# EAGLE design 7DI_V2 R2 (EAGLE 8.6.0)

## Sheet 1 of 8: Contine las fuentes
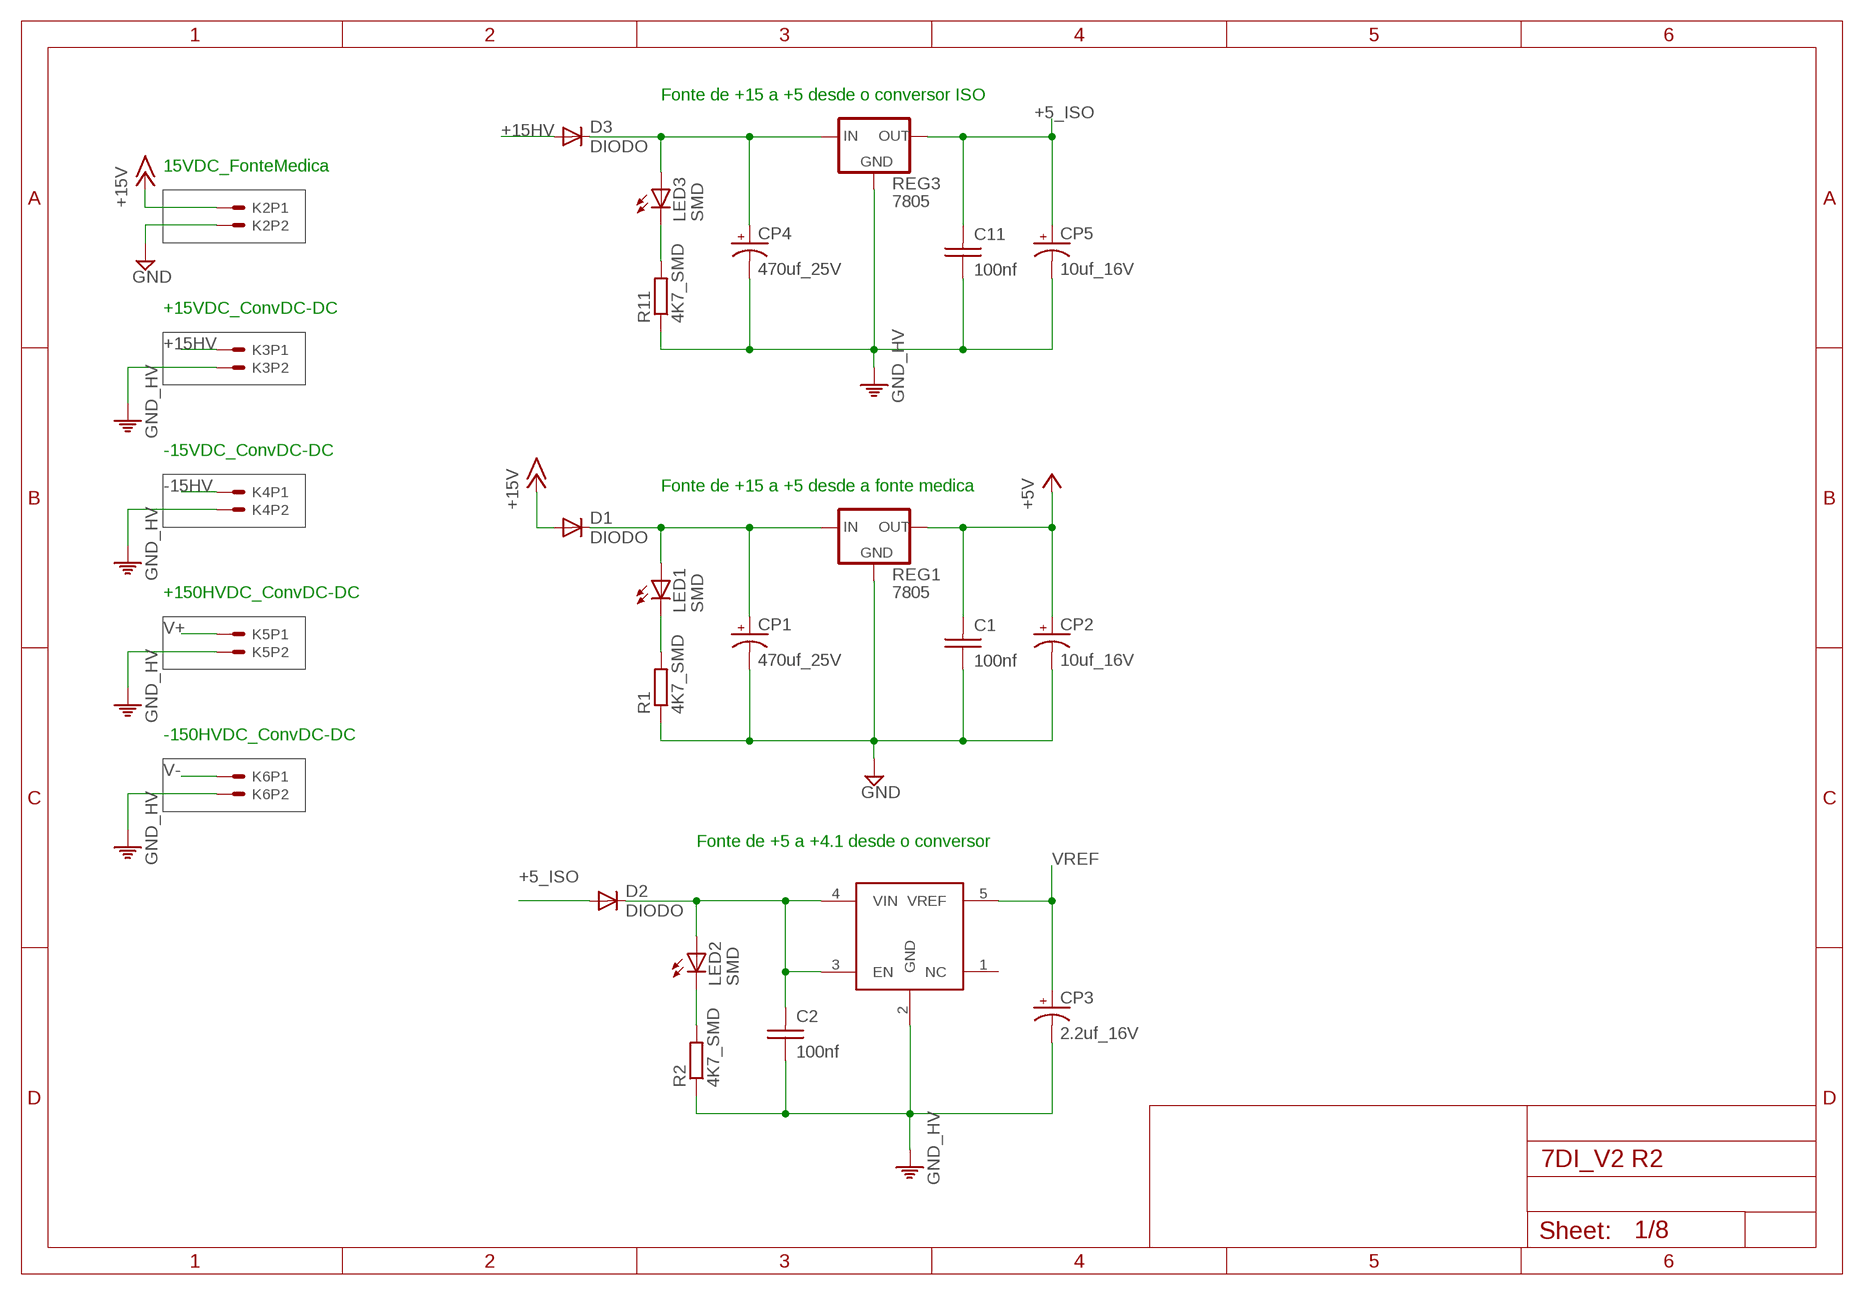
[diagram p0: schematic, sheet 1]

### Parts
C1  100nf  CAP_CERAMICO_TH5  [CAP_CER_5,08-024X044]
C2  100nf  CAP_CERAMICO_SMD  [CAP_CER_SMD-0805]
C11  100nf  CAP_CERAMICO_TH5  [CAP_CER_5,08-024X044]
CP1  470uf_25V  CAP_POLARIZADOCAP_T3,5-D8  [CAP_T_3,5-D8]
CP2  10uf_16V  CAP_POLARIZADOCAP_T2,5-D5  [CAP_T_2,5-D5]
CP3  2.2uf_16V  CAP_POLARIZADOCAPDAC  [153CLV-0605]
CP4  470uf_25V  CAP_POLARIZADOCAP_T3,5-D8  [CAP_T_3,5-D8]
CP5  10uf_16V  CAP_POLARIZADOCAP_T2,5-D5  [CAP_T_2,5-D5]
D1  DIODO  DIODOT_5  [D-5]
D2  DIODO  DIODOT_5  [D-5]
D3  DIODO  DIODOT_5  [D-5]
K2  CONECTOR_5.08  [CONECTOR_X2_5.08]
K3  vcc  CONECTOR_5.08  [CONECTOR_X2_5.08]
K4  vcc  CONECTOR_5.08  [CONECTOR_X2_5.08]
K5  vcc  CONECTOR_5.08  [CONECTOR_X2_5.08]
K6  vcc  CONECTOR_5.08  [CONECTOR_X2_5.08]
LED1  SMD  LEDSMD_0805  [LED_0805]
LED2  SMD  LEDSMD_0805  [LED_0805]
LED3  SMD  LEDSMD_0805  [LED_0805]
R1  4K7_SMD  RESISTORSMD_0805  [RESISTENCIA_0805]
R2  4K7_SMD  RESISTORSMD_0805  [RESISTENCIA_0805]
R11  4K7_SMD  RESISTORSMD_0805  [RESISTENCIA_0805]
REG1  7805  REGULADOR_78XX  [78XXS]
REG2  lm4132_4.1  REGULADOR_LM4132_4.1_SMDREGULADOR_ALTA_PRECISION  [SOT23]
REG3  7805  REGULADOR_78XX  [78XXS]

### Nets
+5_ISO: C11.1 CP5.+ D2.A REG3.OUT ; also sheet 2
+5V: C1.1 CP2.+ REG1.OUT ; also sheet 2,7
+15HV: D3.A K3.1 ; also sheet 3,4,5,6,8
+15V: D1.A K2.1
-15HV: K4.1 ; also sheet 3,4,5,6,8
GND: C1.2 CP1.- CP2.- K2.2 R1.1 REG1.GND ; also sheet 2,7
N$1: CP1.+ D1.C LED1.A REG1.IN
N$3: LED1.C R1.2
N$8: C2.1 D2.C LED2.A REG2.3(EN) REG2.4(VIN)
N$9: LED2.C R2.2
N$18: CP4.+ D3.C LED3.A REG3.IN
N$20: LED3.C R11.2
PE: C2.2 C11.2 CP3.- CP4.- CP5.- K3.2 K4.2 K5.2 K6.2 R2.1 R11.1 REG2.2(GND) REG3.GND ; supply symbol labelled GND_HV ; also sheet 2,3,4,5,6,7,8
V+: K5.1 ; also sheet 3,4,5,6
V-: K6.1 ; also sheet 3,4,5,6
VREF: CP3.+ REG2.5(VREF) ; also sheet 2,3,4,5,6
Unconnected: REG2.1(NC)

### Notes on the sheet
- Fonte de +15 a +5 desde o conversor ISO
- 15VDC_FonteMedica
- +15VDC_ConvDC-DC
- -15VDC_ConvDC-DC
- Fonte de +15 a +5 desde a fonte medica
- +150HVDC_ConvDC-DC
- -150HVDC_ConvDC-DC
- Fonte de +5 a +4.1 desde o conversor

## Sheet 2 of 8: Componentes de los modulos
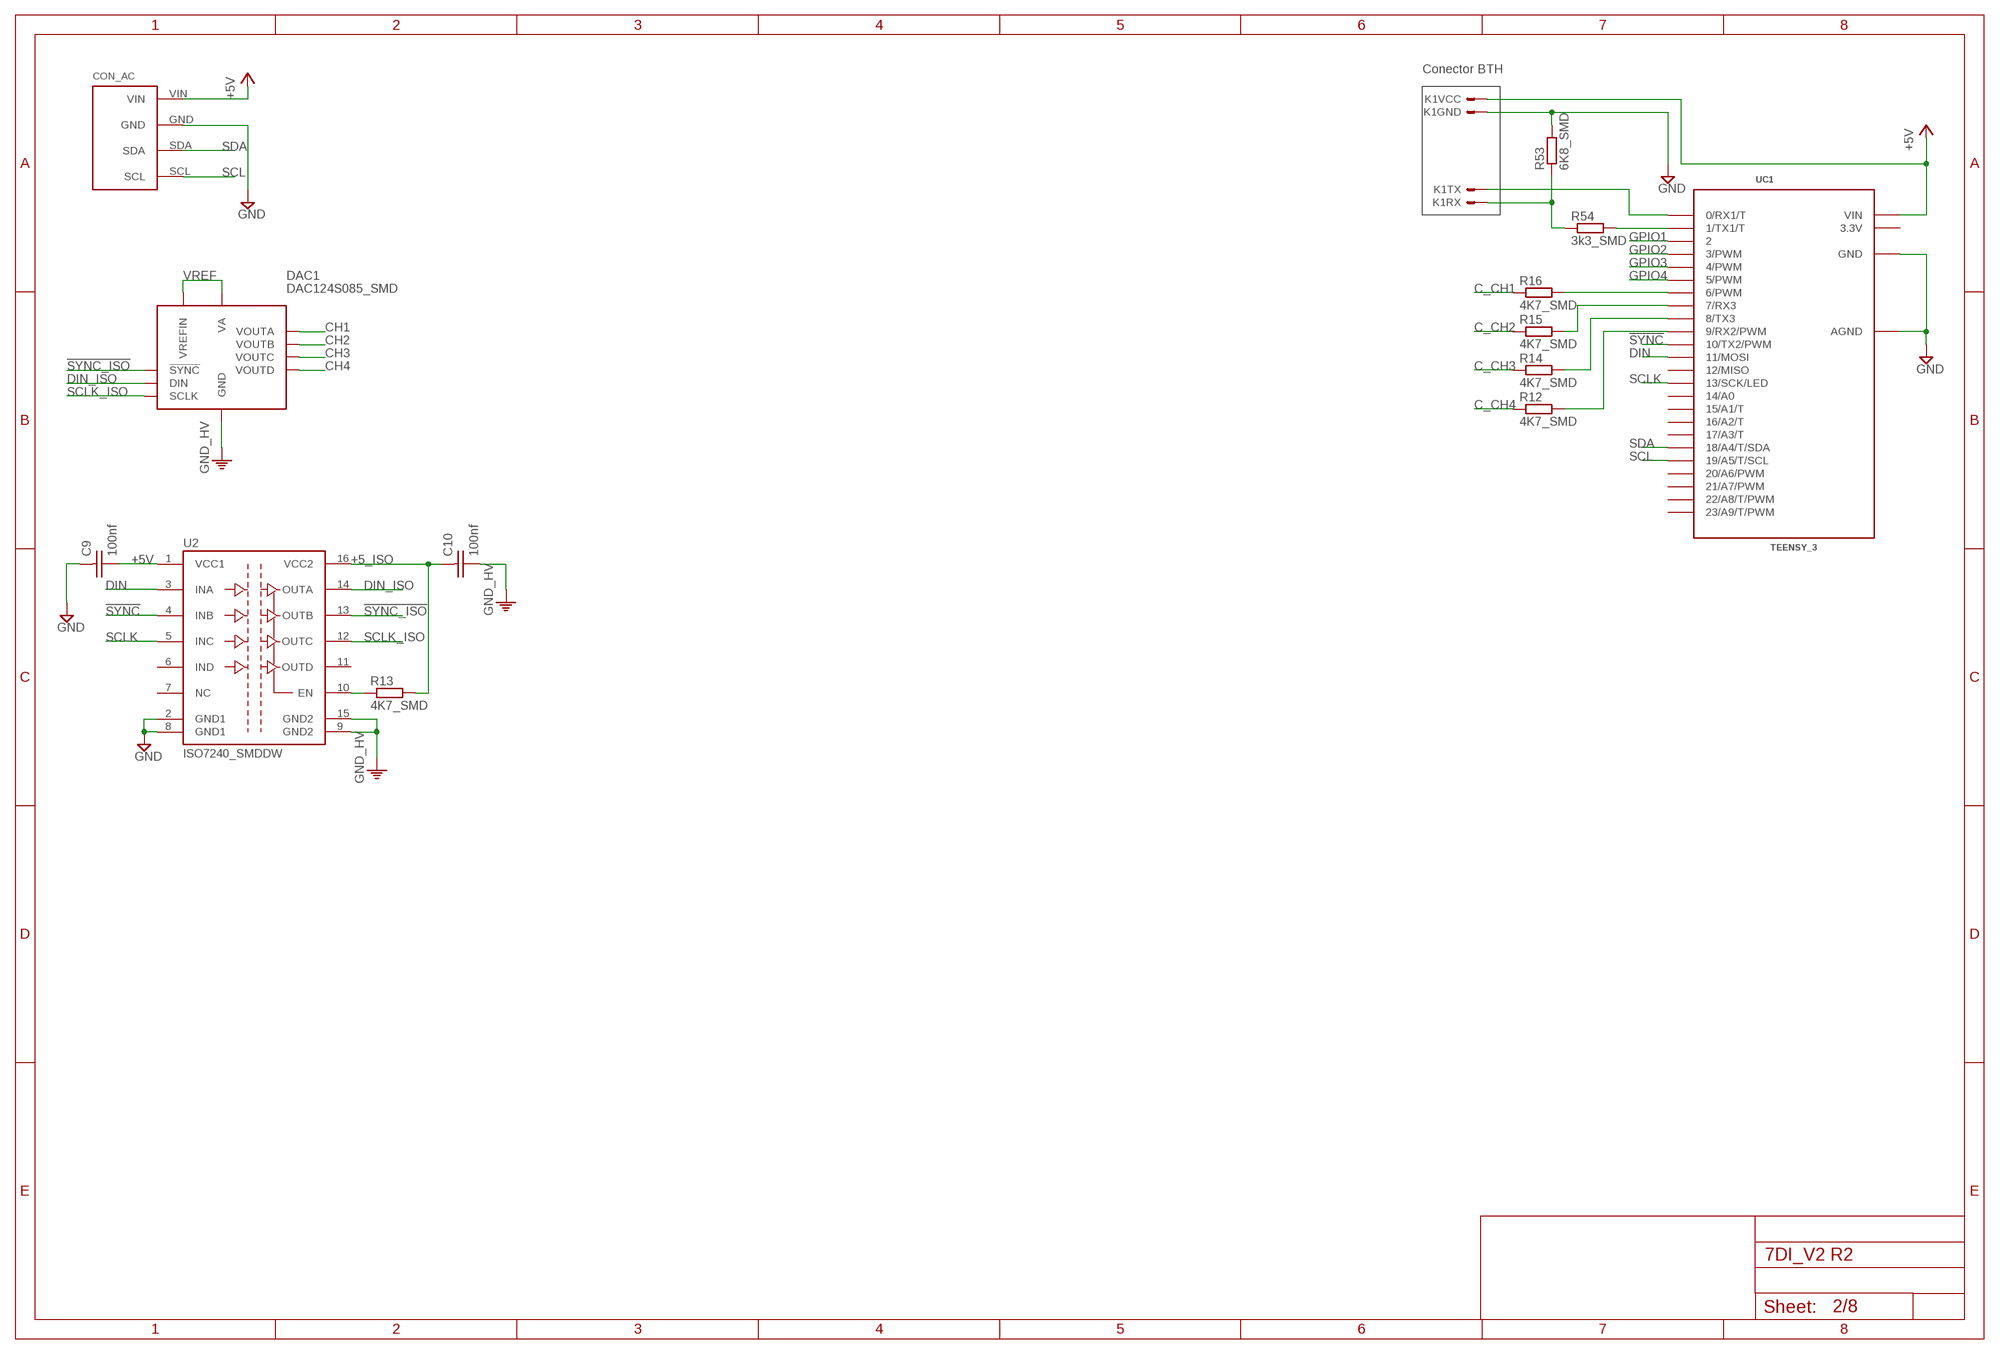
[diagram p1: schematic, sheet 2]

### Parts
C9  100nf  CAP_CERAMICO_SMD  [CAP_CER_SMD-0805]
C10  100nf  CAP_CERAMICO_SMD  [CAP_CER_SMD-0805]
CON_AC  CON_MPU6050  CONECTOR_ACELEROMETRO_MPU6050CONECTOR_MPU6050  [MPU6050]
DAC1  DAC124S085_SMD  [DAC_SO10]
K1  CONECTOR_BTHC-06HC-06  [CONECTOR_BTHC-06]
R12  4K7_SMD  RESISTORSMD_0805  [RESISTENCIA_0805]
R13  4K7_SMD  RESISTORSMD_0805  [RESISTENCIA_0805]
R14  4K7_SMD  RESISTORSMD_0805  [RESISTENCIA_0805]
R15  4K7_SMD  RESISTORSMD_0805  [RESISTENCIA_0805]
R16  4K7_SMD  RESISTORSMD_0805  [RESISTENCIA_0805]
R53  6K8_SMD  RESISTORSMD_0805  [RESISTENCIA_0805]
R54  3k3_SMD  RESISTORSMD_0805  [RESISTENCIA_0805]
U2  ISO7240_SMDDW  [SO-16DW]
UC1  TEENSY_3  TEENSY_3.0_A_3.2VERSION_MINIMA  [TEENSY_3.0-3.2_DIL]

### Nets
!SYNC: U2.4(INB) UC1.10(10/TX2/PWM)
!SYNC_ISO: DAC1.9(!SYNC!) U2.13(OUTB)
+5_ISO: C10.1 R13.2 U2.16(VCC2) ; also sheet 1
+5V: C9.2 CON_AC.VIN K1.1 U2.1(VCC1) UC1.VIN ; also sheet 1,7
C_CH1: R16.1 ; also sheet 7
C_CH2: R15.1 ; also sheet 7
C_CH3: R14.1 ; also sheet 7
C_CH4: R12.1 ; also sheet 7
CH1: DAC1.2(VOUTA) ; also sheet 3
CH2: DAC1.3(VOUTB) ; also sheet 4
CH3: DAC1.4(VOUTC) ; also sheet 5
CH4: DAC1.5(VOUTD) ; also sheet 6
DIN: U2.3(INA) UC1.11(11/MOSI)
DIN_ISO: DAC1.8(DIN) U2.14(OUTA)
GND: C9.1 CON_AC.GND K1.2 R53.2 U2.2(GND1) U2.8(GND1) UC1.AGND UC1.GND ; also sheet 1,7
GPIO1: UC1.2
GPIO2: UC1.3(3/PWM)
GPIO3: UC1.4(4/PWM)
GPIO4: UC1.5(5/PWM)
N$2: K1.4 R53.1 R54.1
N$4: R54.2 UC1.1(1/TX1/T)
N$23: R13.1 U2.10(EN)
N$25: R16.2 UC1.6(6/PWM)
N$26: R15.2 UC1.7(7/RX3)
N$30: R14.2 UC1.8(8/TX3)
N$31: R12.2 UC1.9(9/RX2/PWM)
N$103: K1.3 UC1.0(0/RX1/T)
PE: C10.2 DAC1.6(GND) U2.9(GND2) U2.15(GND2) ; supply symbol labelled GND_HV ; also sheet 1,3,4,5,6,7,8
SCL: CON_AC.SCL UC1.19/A5(19/A5/T/SCL)
SCLK: U2.5(INC) UC1.13(13/SCK/LED)
SCLK_ISO: DAC1.10(SCLK) U2.12(OUTC)
SDA: CON_AC.SDA UC1.18/A4(18/A4/T/SDA)
VREF: DAC1.1(VA) DAC1.7(VREFIN) ; also sheet 1,3,4,5,6
Unconnected: U2.6(IND) U2.7(NC) U2.11(OUTD) UC1.12(12/MISO) UC1.14/A0 UC1.15/A1(15/A1/T) UC1.16/A2(16/A2/T) UC1.17/A3(17/A3/T) UC1.20/A6(20/A6/PWM) UC1.21/A7(21/A7/PWM) UC1.22/A8(22/A8/T/PWM) UC1.23/A9(23/A9/T/PWM)

### Notes on the sheet
- Conector BTH

## Sheet 3 of 8: Canal 1
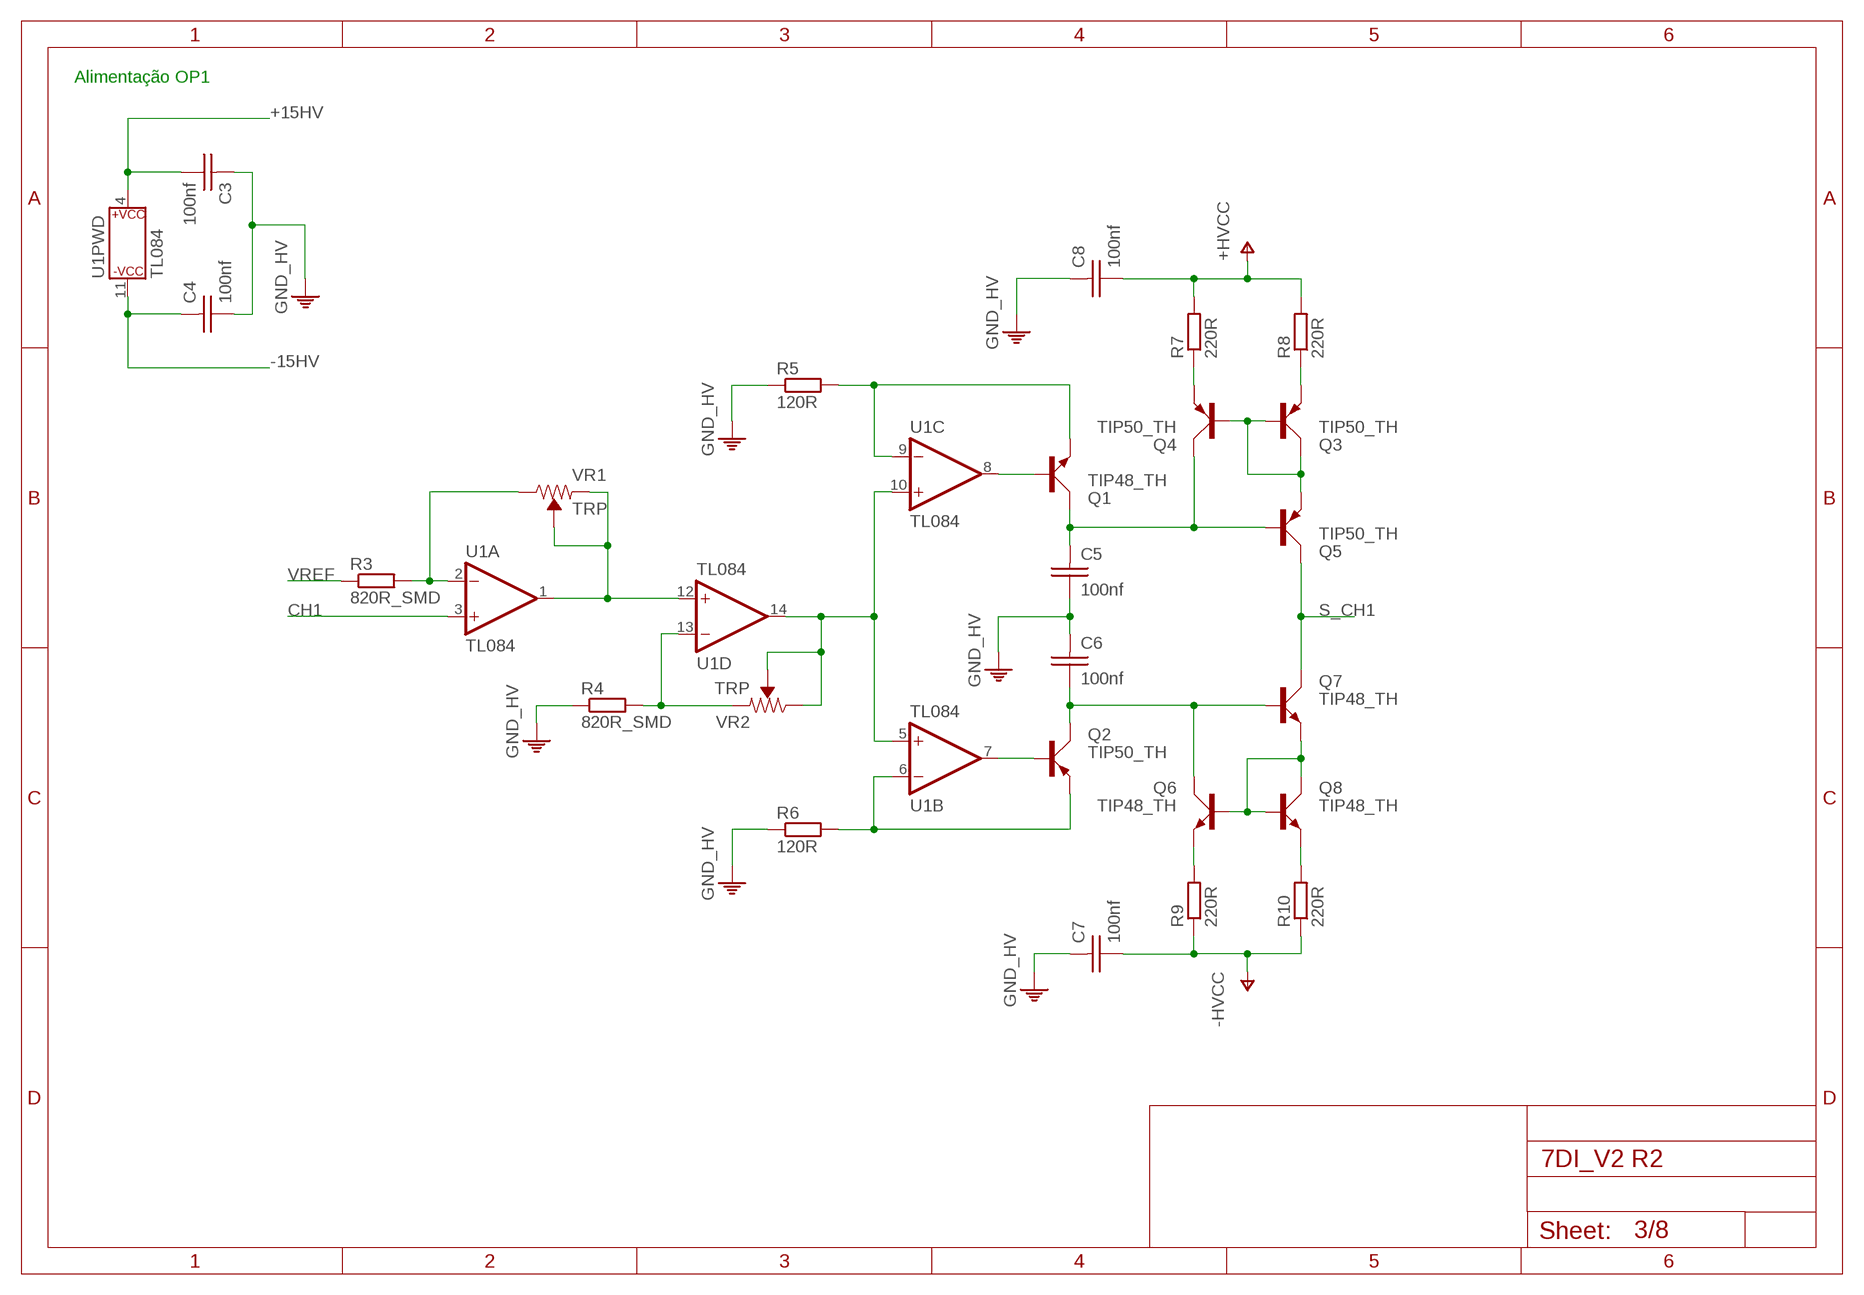
[diagram p2: schematic, sheet 3]

### Parts
C3  100nf  CAP_CERAMICO_SMD  [CAP_CER_SMD-0805]
C4  100nf  CAP_CERAMICO_SMD  [CAP_CER_SMD-0805]
C5  100nf  CAP_CERAMICO_TH2  [CAP_CER_2,54-5X5]
C6  100nf  CAP_CERAMICO_TH2  [CAP_CER_2,54-5X5]
C7  100nf  CAP_CERAMICO_TH16  [CAP_CER_16X7]
C8  100nf  CAP_CERAMICO_TH16  [CAP_CER_16X7]
Q1  TIP48_TH  [TO220]
Q2  TIP50_TH  [TO220]
Q3  TIP50_TH  [TO220]
Q4  TIP50_TH  [TO220]
Q5  TIP50_TH  [TO220]
Q6  TIP48_TH  [TO220]
Q7  TIP48_TH  [TO220]
Q8  TIP48_TH  [TO220]
R3  820R_SMD  RESISTORSMD_0805  [RESISTENCIA_0805]
R4  820R_SMD  RESISTORSMD_0805  [RESISTENCIA_0805]
R5  120R  RESISTORT_CORTO  [0204V]
R6  120R  RESISTORT_CORTO  [0204V]
R7  220R  RESISTORT_CORTO  [0204V]
R8  220R  RESISTORT_CORTO  [0204V]
R9  220R  RESISTORT_CORTO  [0204V]
R10  220R  RESISTORT_CORTO  [0204V]
U1  TL084  TL084_SMD  [SO14OP]
VR1  TRP  TRIMPOT_TH  [TRIMPOT-PTH-3386U]
VR2  TRP  TRIMPOT_TH  [TRIMPOT-PTH-3386U]

### Nets
+15HV: C3.2 U1.4(PWD:P$V+) ; also sheet 1,4,5,6,8
-15HV: C4.1 U1.11(PWD:P$V-) ; also sheet 1,4,5,6,8
CH1: U1.3(A:+IN) ; also sheet 2
GS_CH1: U1.5(B:+IN) U1.10(C:+IN) U1.14(D:OUT) VR2.2(WIPER) VR2.3(CW) ; also sheet 8
N$5: R3.2 U1.2(A:-IN) VR1.3(CW)
N$6: Q1.B U1.8(C:OUT)
N$7: U1.1(A:OUT) U1.12(D:+IN) VR1.1(CCW) VR1.2(WIPER)
N$12: Q1.E R5.2 U1.9(C:-IN)
N$14: Q2.B U1.7(B:OUT)
N$15: R4.2 U1.13(D:-IN) VR2.1(CCW)
N$16: Q2.E R6.2 U1.6(B:-IN)
N$17: C6.2 Q2.C Q6.C Q7.B
N$19: C5.1 Q1.C Q4.C Q5.B
N$21: Q4.E R7.1
N$22: Q3.E R8.1
N$24: Q3.B Q3.C Q4.B Q5.E
N$27: Q6.B Q7.E Q8.B Q8.C
N$28: Q6.E R9.2
N$29: Q8.E R10.2
PE: C3.1 C4.2 C5.2 C6.1 C7.1 C8.1 R4.1 R5.1 R6.1 ; supply symbol labelled GND_HV ; also sheet 1,2,4,5,6,7,8
S_CH1: Q5.C Q7.C ; also sheet 7
V+: C8.2 R7.2 R8.2 ; supply symbol labelled +HVCC ; also sheet 1,4,5,6
V-: C7.2 R9.1 R10.1 ; supply symbol labelled -HVCC ; also sheet 1,4,5,6
VREF: R3.1 ; also sheet 1,2,4,5,6

### Notes on the sheet
- Alimentação OP1

## Sheet 4 of 8: Canal 2
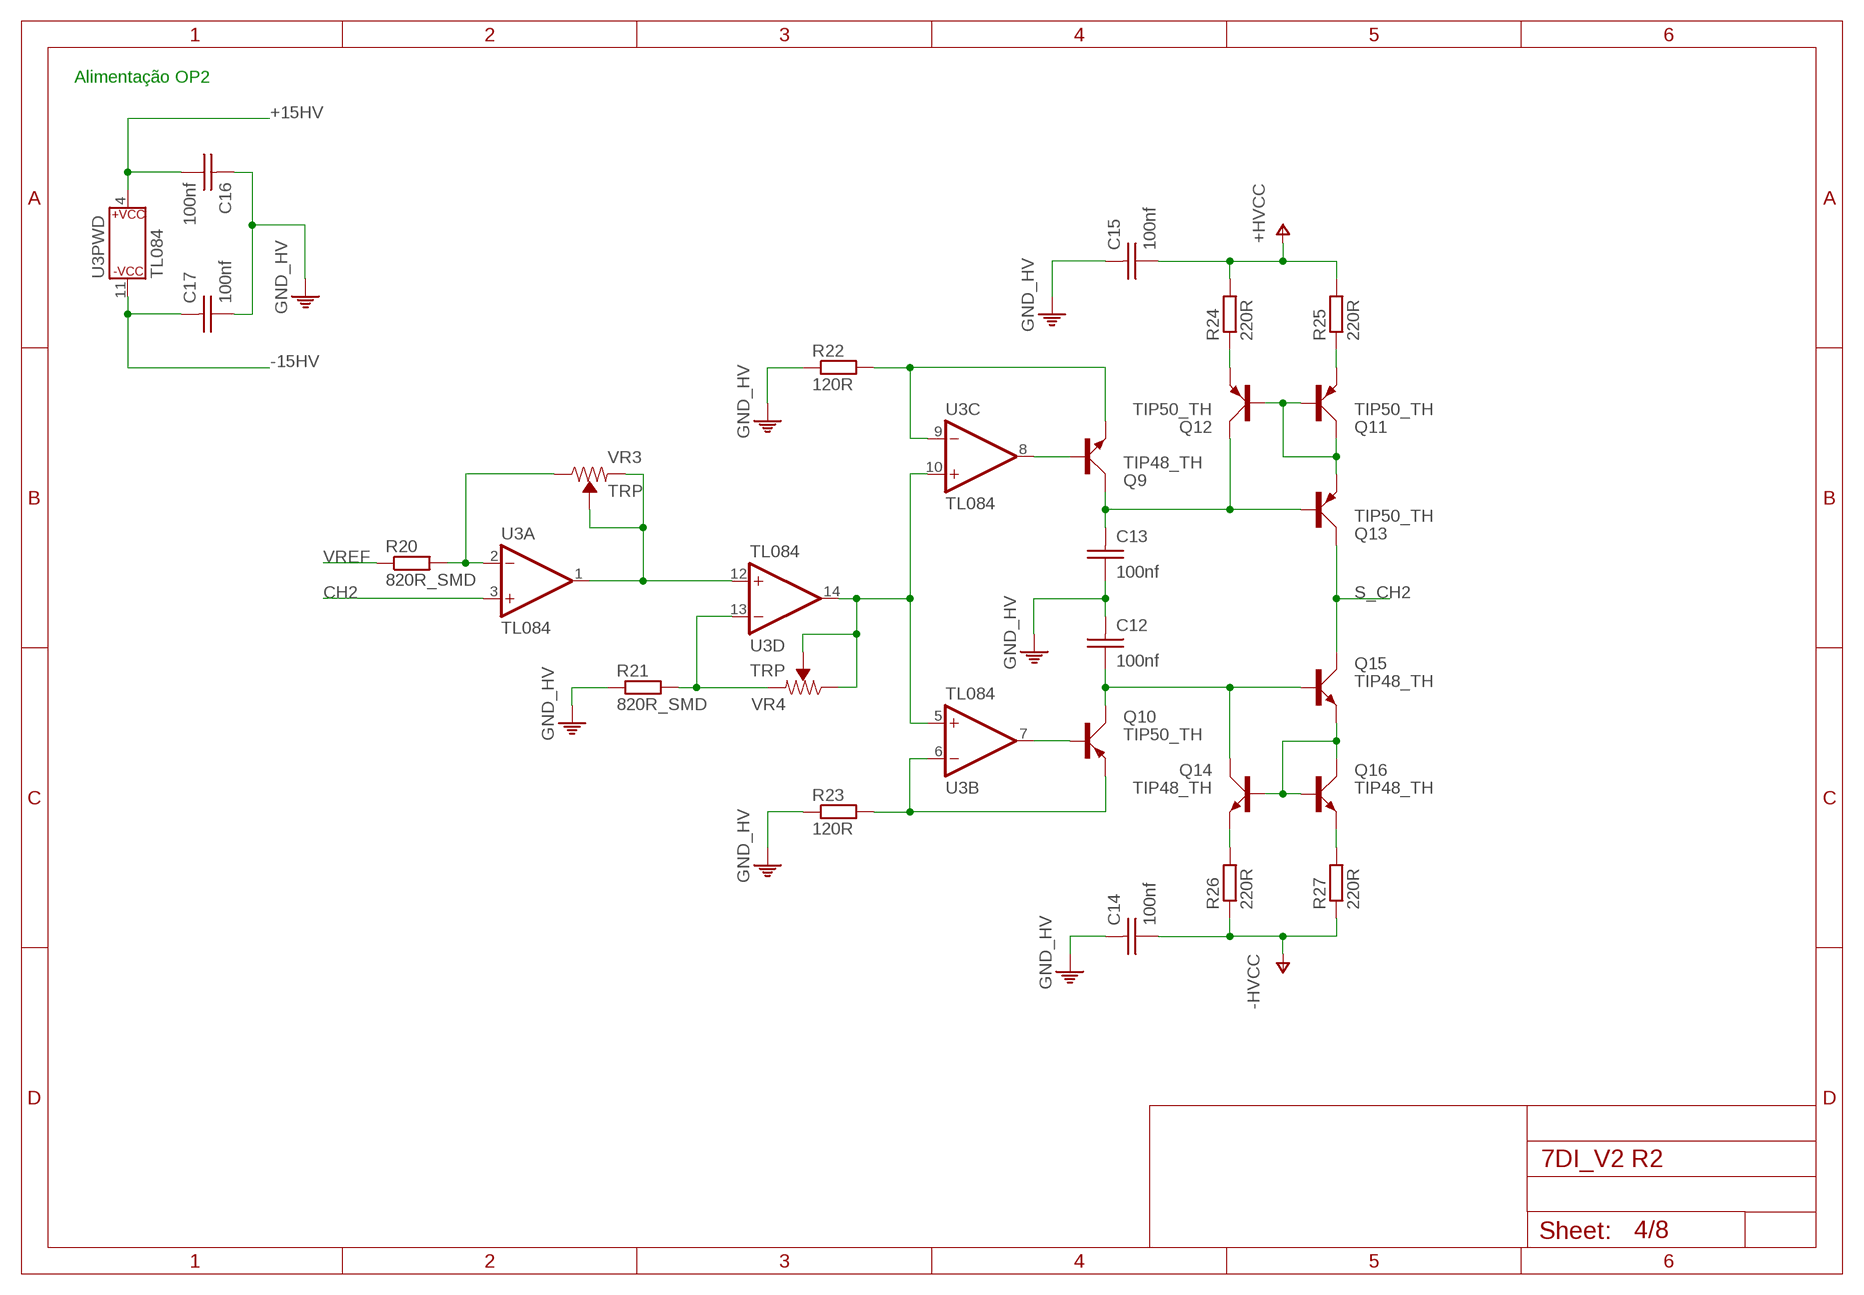
[diagram p3: schematic, sheet 4]

### Parts
C12  100nf  CAP_CERAMICO_TH2  [CAP_CER_2,54-5X5]
C13  100nf  CAP_CERAMICO_TH2  [CAP_CER_2,54-5X5]
C14  100nf  CAP_CERAMICO_TH16  [CAP_CER_16X7]
C15  100nf  CAP_CERAMICO_TH16  [CAP_CER_16X7]
C16  100nf  CAP_CERAMICO_SMD  [CAP_CER_SMD-0805]
C17  100nf  CAP_CERAMICO_SMD  [CAP_CER_SMD-0805]
Q9  TIP48_TH  [TO220]
Q10  TIP50_TH  [TO220]
Q11  TIP50_TH  [TO220]
Q12  TIP50_TH  [TO220]
Q13  TIP50_TH  [TO220]
Q14  TIP48_TH  [TO220]
Q15  TIP48_TH  [TO220]
Q16  TIP48_TH  [TO220]
R20  820R_SMD  RESISTORSMD_0805  [RESISTENCIA_0805]
R21  820R_SMD  RESISTORSMD_0805  [RESISTENCIA_0805]
R22  120R  RESISTORT_CORTO  [0204V]
R23  120R  RESISTORT_CORTO  [0204V]
R24  220R  RESISTORT_CORTO  [0204V]
R25  220R  RESISTORT_CORTO  [0204V]
R26  220R  RESISTORT_CORTO  [0204V]
R27  220R  RESISTORT_CORTO  [0204V]
U3  TL084  TL084_SMD  [SO14OP]
VR3  TRP  TRIMPOT_TH  [TRIMPOT-PTH-3386U]
VR4  TRP  TRIMPOT_TH  [TRIMPOT-PTH-3386U]

### Nets
+15HV: C16.2 U3.4(PWD:P$V+) ; also sheet 1,3,5,6,8
-15HV: C17.1 U3.11(PWD:P$V-) ; also sheet 1,3,5,6,8
CH2: U3.3(A:+IN) ; also sheet 2
N$34: R20.2 U3.2(A:-IN) VR3.3(CW)
N$35: U3.1(A:OUT) U3.12(D:+IN) VR3.1(CCW) VR3.2(WIPER)
N$37: U3.5(B:+IN) U3.10(C:+IN) U3.14(D:OUT) VR4.2(WIPER) VR4.3(CW)
N$39: R21.2 U3.13(D:-IN) VR4.1(CCW)
N$40: Q9.E R22.2 U3.9(C:-IN)
N$41: Q10.B U3.7(B:OUT)
N$42: Q10.E R23.2 U3.6(B:-IN)
N$43: C12.2 Q10.C Q14.C Q15.B
N$44: C13.1 Q9.C Q12.C Q13.B
N$45: Q12.E R24.1
N$46: Q11.E R25.1
N$47: Q11.B Q11.C Q12.B Q13.E
N$48: Q14.B Q15.E Q16.B Q16.C
N$49: Q14.E R26.2
N$50: Q16.E R27.2
N$51: Q9.B U3.8(C:OUT)
PE: C12.1 C13.2 C14.1 C15.1 C16.1 C17.2 R21.1 R22.1 R23.1 ; supply symbol labelled GND_HV ; also sheet 1,2,3,5,6,7,8
S_CH2: Q13.C Q15.C ; also sheet 7
V+: C15.2 R24.2 R25.2 ; supply symbol labelled +HVCC ; also sheet 1,3,5,6
V-: C14.2 R26.1 R27.1 ; supply symbol labelled -HVCC ; also sheet 1,3,5,6
VREF: R20.1 ; also sheet 1,2,3,5,6

### Notes on the sheet
- Alimentação OP2

## Sheet 5 of 8: Canal 3
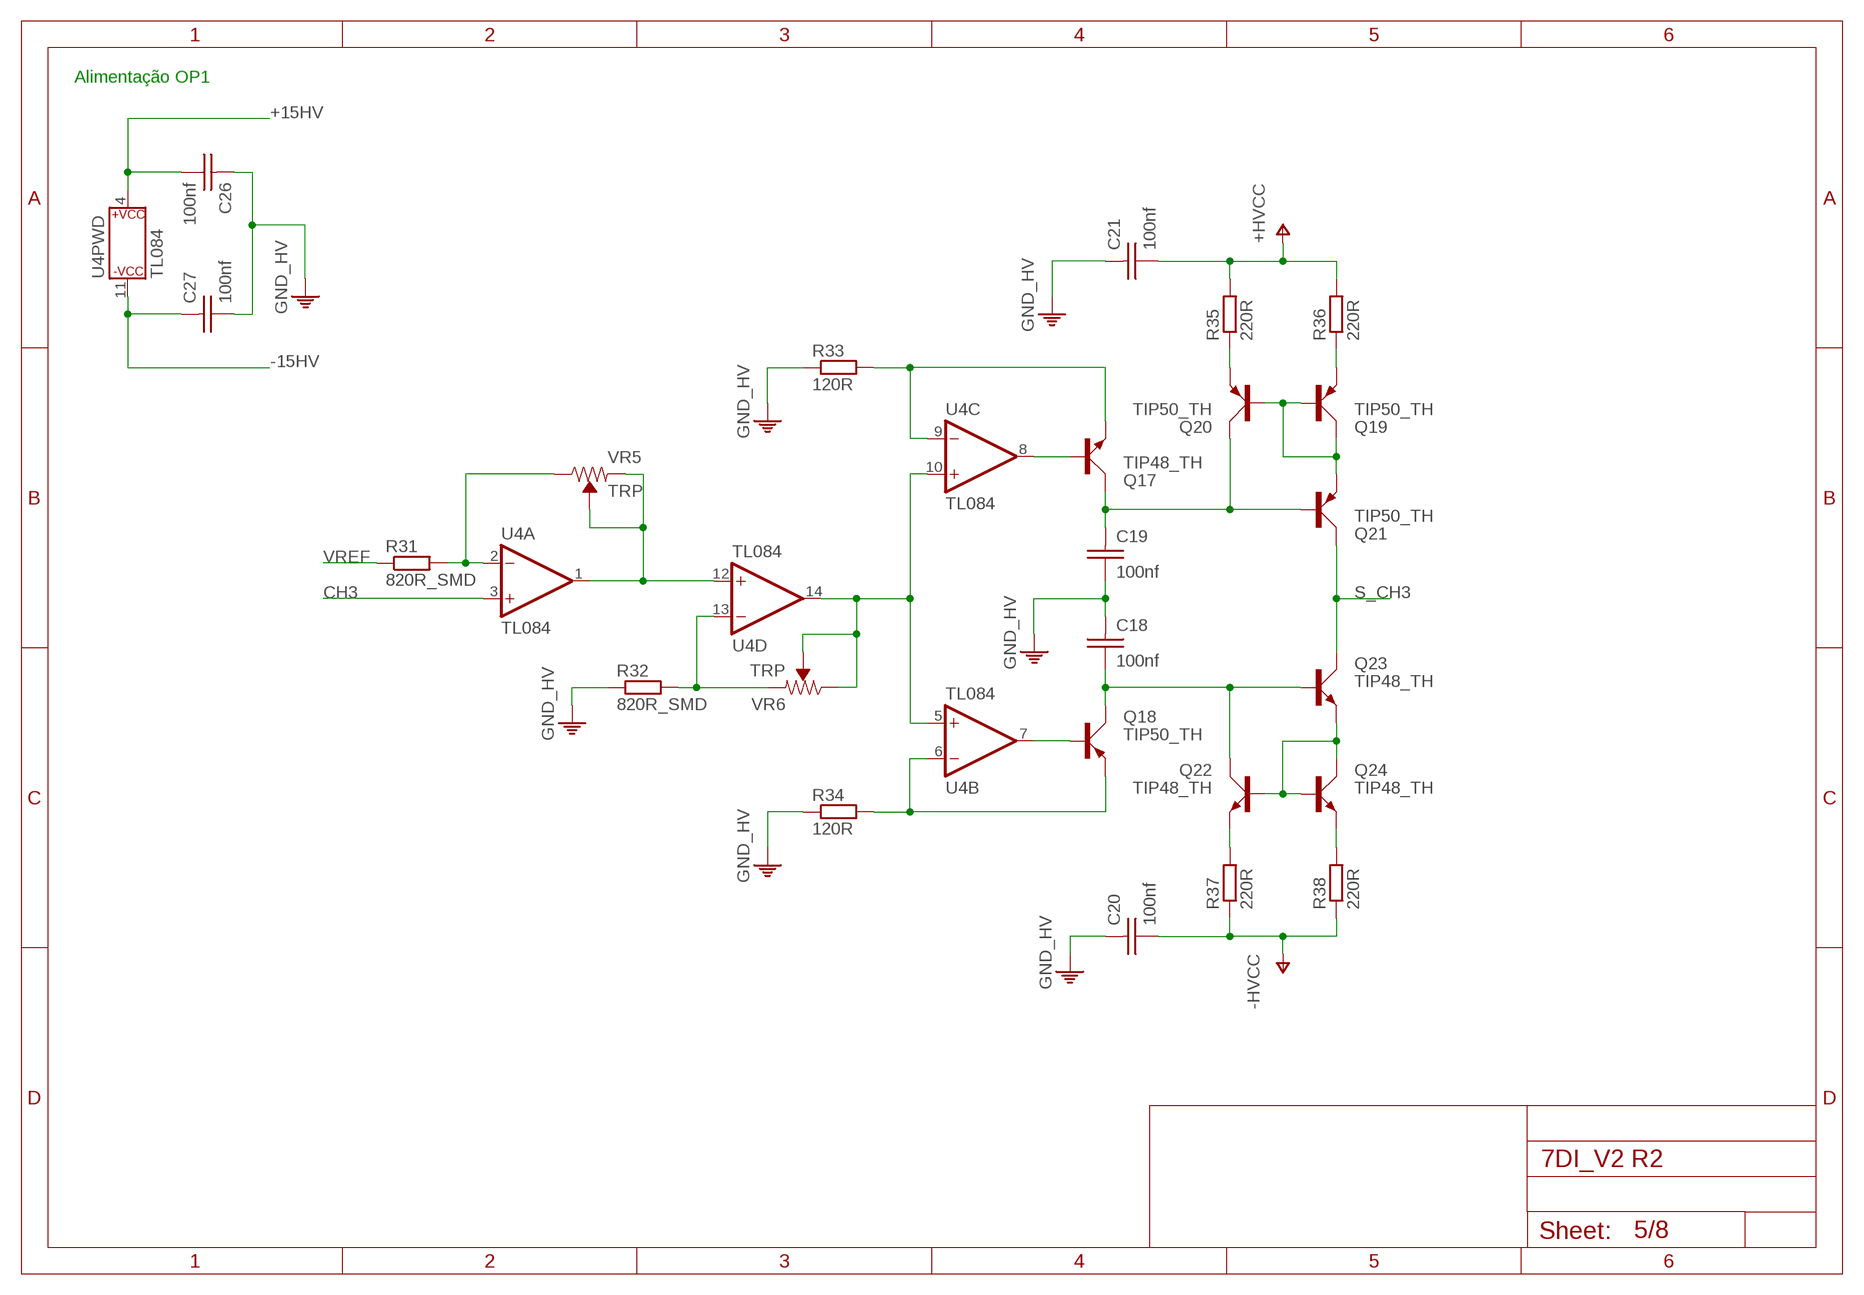
[diagram p4: schematic, sheet 5]

### Parts
C18  100nf  CAP_CERAMICO_TH2  [CAP_CER_2,54-5X5]
C19  100nf  CAP_CERAMICO_TH2  [CAP_CER_2,54-5X5]
C20  100nf  CAP_CERAMICO_TH16  [CAP_CER_16X7]
C21  100nf  CAP_CERAMICO_TH16  [CAP_CER_16X7]
C26  100nf  CAP_CERAMICO_SMD  [CAP_CER_SMD-0805]
C27  100nf  CAP_CERAMICO_SMD  [CAP_CER_SMD-0805]
Q17  TIP48_TH  [TO220]
Q18  TIP50_TH  [TO220]
Q19  TIP50_TH  [TO220]
Q20  TIP50_TH  [TO220]
Q21  TIP50_TH  [TO220]
Q22  TIP48_TH  [TO220]
Q23  TIP48_TH  [TO220]
Q24  TIP48_TH  [TO220]
R31  820R_SMD  RESISTORSMD_0805  [RESISTENCIA_0805]
R32  820R_SMD  RESISTORSMD_0805  [RESISTENCIA_0805]
R33  120R  RESISTORT_CORTO  [0204V]
R34  120R  RESISTORT_CORTO  [0204V]
R35  220R  RESISTORT_CORTO  [0204V]
R36  220R  RESISTORT_CORTO  [0204V]
R37  220R  RESISTORT_CORTO  [0204V]
R38  220R  RESISTORT_CORTO  [0204V]
U4  TL084  TL084_SMD  [SO14OP]
VR5  TRP  TRIMPOT_TH  [TRIMPOT-PTH-3386U]
VR6  TRP  TRIMPOT_TH  [TRIMPOT-PTH-3386U]

### Nets
+15HV: C26.2 U4.4(PWD:P$V+) ; also sheet 1,3,4,6,8
-15HV: C27.1 U4.11(PWD:P$V-) ; also sheet 1,3,4,6,8
CH3: U4.3(A:+IN) ; also sheet 2
N$58: R31.2 U4.2(A:-IN) VR5.3(CW)
N$59: U4.1(A:OUT) U4.12(D:+IN) VR5.1(CCW) VR5.2(WIPER)
N$60: U4.5(B:+IN) U4.10(C:+IN) U4.14(D:OUT) VR6.2(WIPER) VR6.3(CW)
N$61: R32.2 U4.13(D:-IN) VR6.1(CCW)
N$62: Q17.E R33.2 U4.9(C:-IN)
N$63: Q18.B U4.7(B:OUT)
N$64: Q18.E R34.2 U4.6(B:-IN)
N$65: C18.2 Q18.C Q22.C Q23.B
N$66: C19.1 Q17.C Q20.C Q21.B
N$67: Q20.E R35.1
N$68: Q19.E R36.1
N$69: Q19.B Q19.C Q20.B Q21.E
N$70: Q22.B Q23.E Q24.B Q24.C
N$71: Q22.E R37.2
N$72: Q24.E R38.2
N$73: Q17.B U4.8(C:OUT)
PE: C18.1 C19.2 C20.1 C21.1 C26.1 C27.2 R32.1 R33.1 R34.1 ; supply symbol labelled GND_HV ; also sheet 1,2,3,4,6,7,8
S_CH3: Q21.C Q23.C ; also sheet 7
V+: C21.2 R35.2 R36.2 ; supply symbol labelled +HVCC ; also sheet 1,3,4,6
V-: C20.2 R37.1 R38.1 ; supply symbol labelled -HVCC ; also sheet 1,3,4,6
VREF: R31.1 ; also sheet 1,2,3,4,6

### Notes on the sheet
- Alimentação OP1

## Sheet 6 of 8: Canal 4
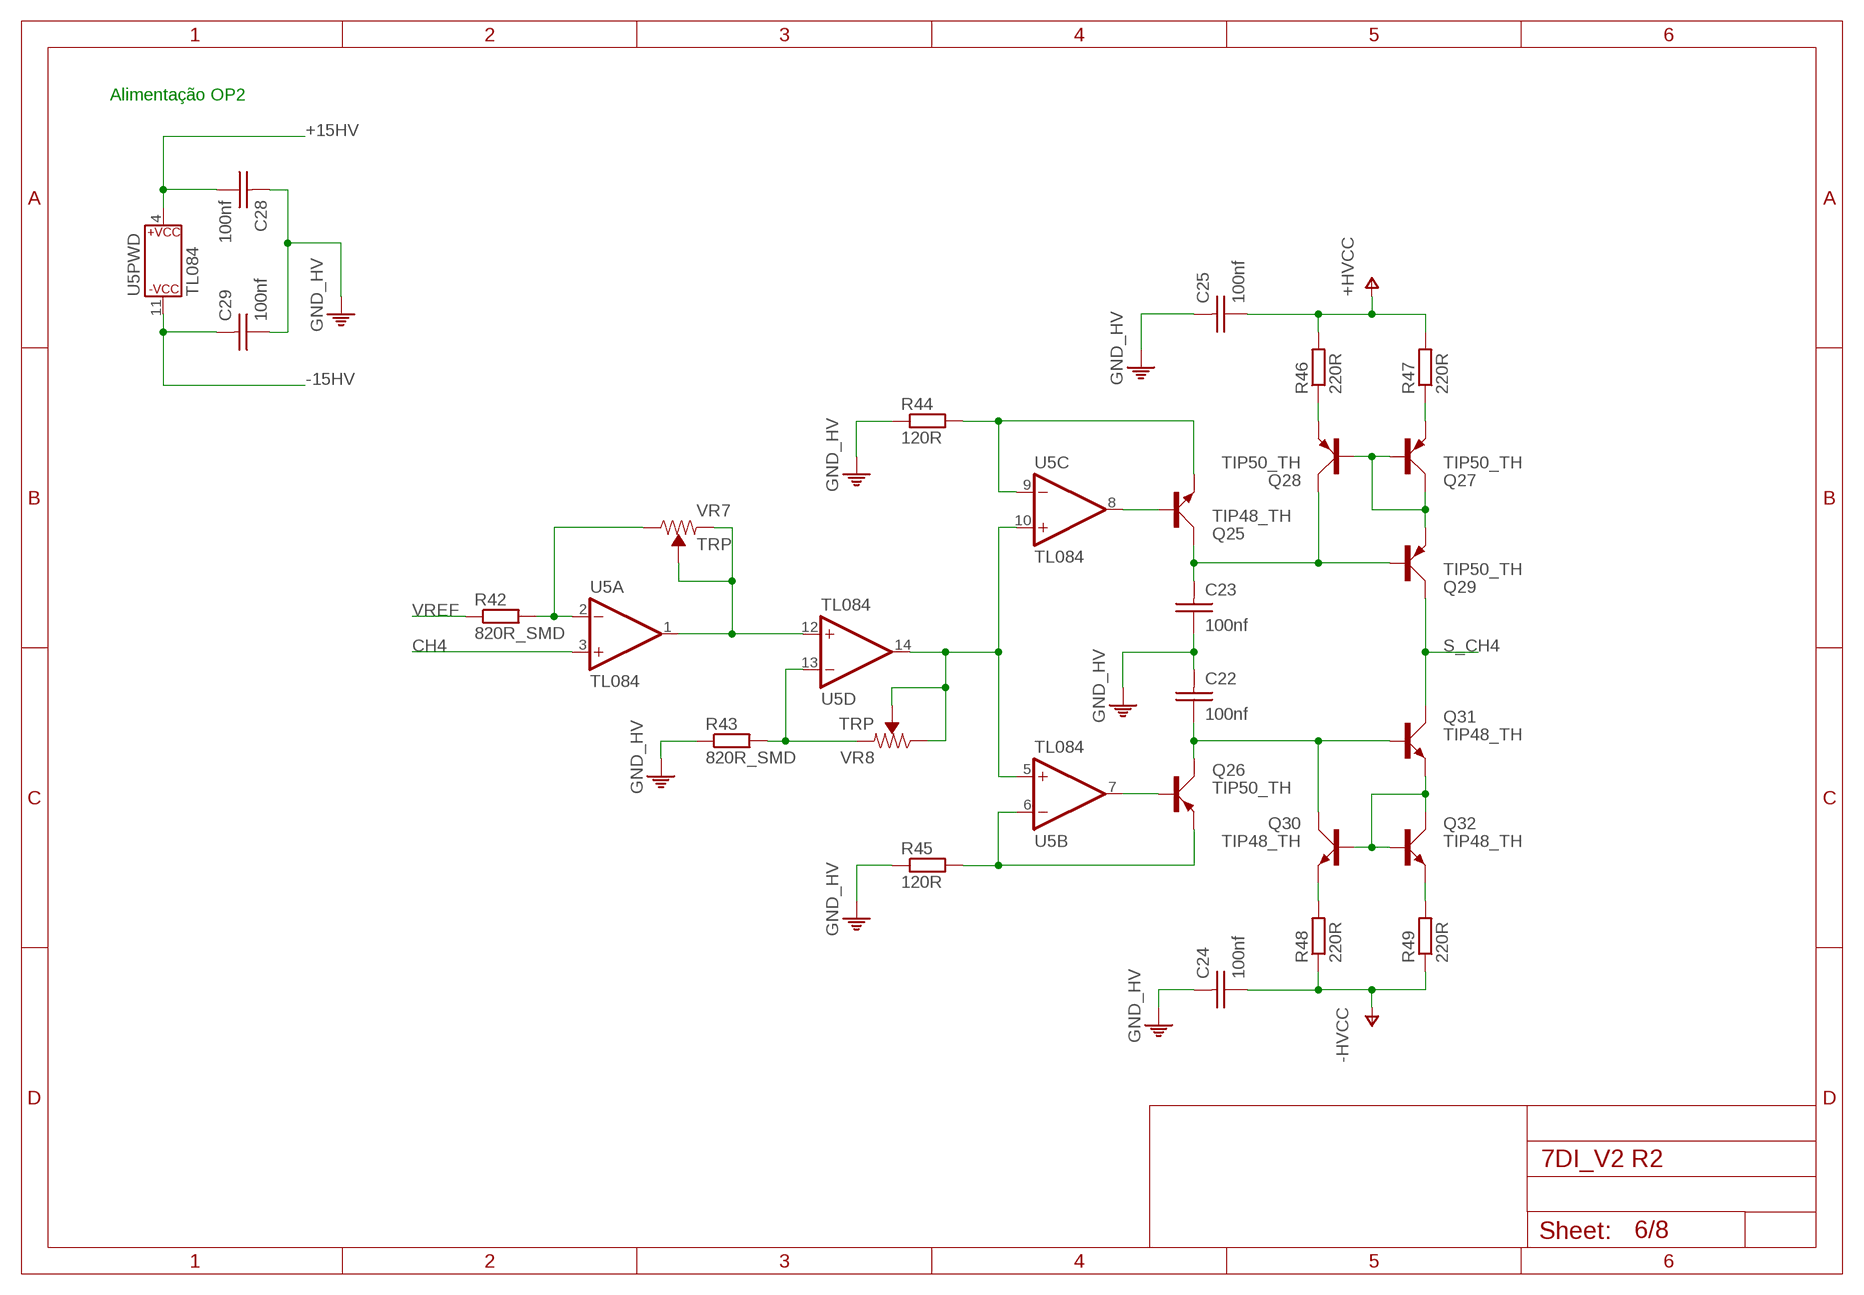
[diagram p5: schematic, sheet 6]

### Parts
C22  100nf  CAP_CERAMICO_TH2  [CAP_CER_2,54-5X5]
C23  100nf  CAP_CERAMICO_TH2  [CAP_CER_2,54-5X5]
C24  100nf  CAP_CERAMICO_TH16  [CAP_CER_16X7]
C25  100nf  CAP_CERAMICO_TH16  [CAP_CER_16X7]
C28  100nf  CAP_CERAMICO_SMD  [CAP_CER_SMD-0805]
C29  100nf  CAP_CERAMICO_SMD  [CAP_CER_SMD-0805]
Q25  TIP48_TH  [TO220]
Q26  TIP50_TH  [TO220]
Q27  TIP50_TH  [TO220]
Q28  TIP50_TH  [TO220]
Q29  TIP50_TH  [TO220]
Q30  TIP48_TH  [TO220]
Q31  TIP48_TH  [TO220]
Q32  TIP48_TH  [TO220]
R42  820R_SMD  RESISTORSMD_0805  [RESISTENCIA_0805]
R43  820R_SMD  RESISTORSMD_0805  [RESISTENCIA_0805]
R44  120R  RESISTORT_CORTO  [0204V]
R45  120R  RESISTORT_CORTO  [0204V]
R46  220R  RESISTORT_CORTO  [0204V]
R47  220R  RESISTORT_CORTO  [0204V]
R48  220R  RESISTORT_CORTO  [0204V]
R49  220R  RESISTORT_CORTO  [0204V]
U5  TL084  TL084_SMD  [SO14OP]
VR7  TRP  TRIMPOT_TH  [TRIMPOT-PTH-3386U]
VR8  TRP  TRIMPOT_TH  [TRIMPOT-PTH-3386U]

### Nets
+15HV: C28.2 U5.4(PWD:P$V+) ; also sheet 1,3,4,5,8
-15HV: C29.1 U5.11(PWD:P$V-) ; also sheet 1,3,4,5,8
CH4: U5.3(A:+IN) ; also sheet 2
N$78: R42.2 U5.2(A:-IN) VR7.3(CW)
N$79: U5.1(A:OUT) U5.12(D:+IN) VR7.1(CCW) VR7.2(WIPER)
N$80: U5.5(B:+IN) U5.10(C:+IN) U5.14(D:OUT) VR8.2(WIPER) VR8.3(CW)
N$81: R43.2 U5.13(D:-IN) VR8.1(CCW)
N$82: Q25.E R44.2 U5.9(C:-IN)
N$83: Q26.B U5.7(B:OUT)
N$84: Q26.E R45.2 U5.6(B:-IN)
N$85: C22.2 Q26.C Q30.C Q31.B
N$86: C23.1 Q25.C Q28.C Q29.B
N$87: Q28.E R46.1
N$88: Q27.E R47.1
N$89: Q27.B Q27.C Q28.B Q29.E
N$90: Q30.B Q31.E Q32.B Q32.C
N$91: Q30.E R48.2
N$92: Q32.E R49.2
N$93: Q25.B U5.8(C:OUT)
PE: C22.1 C23.2 C24.1 C25.1 C28.1 C29.2 R43.1 R44.1 R45.1 ; supply symbol labelled GND_HV ; also sheet 1,2,3,4,5,7,8
S_CH4: Q29.C Q31.C ; also sheet 7
V+: C25.2 R46.2 R47.2 ; supply symbol labelled +HVCC ; also sheet 1,3,4,5
V-: C24.2 R48.1 R49.1 ; supply symbol labelled -HVCC ; also sheet 1,3,4,5
VREF: R42.1 ; also sheet 1,2,3,4,5

### Notes on the sheet
- Alimentação OP2

## Sheet 7 of 8: Contiene el selector de canales
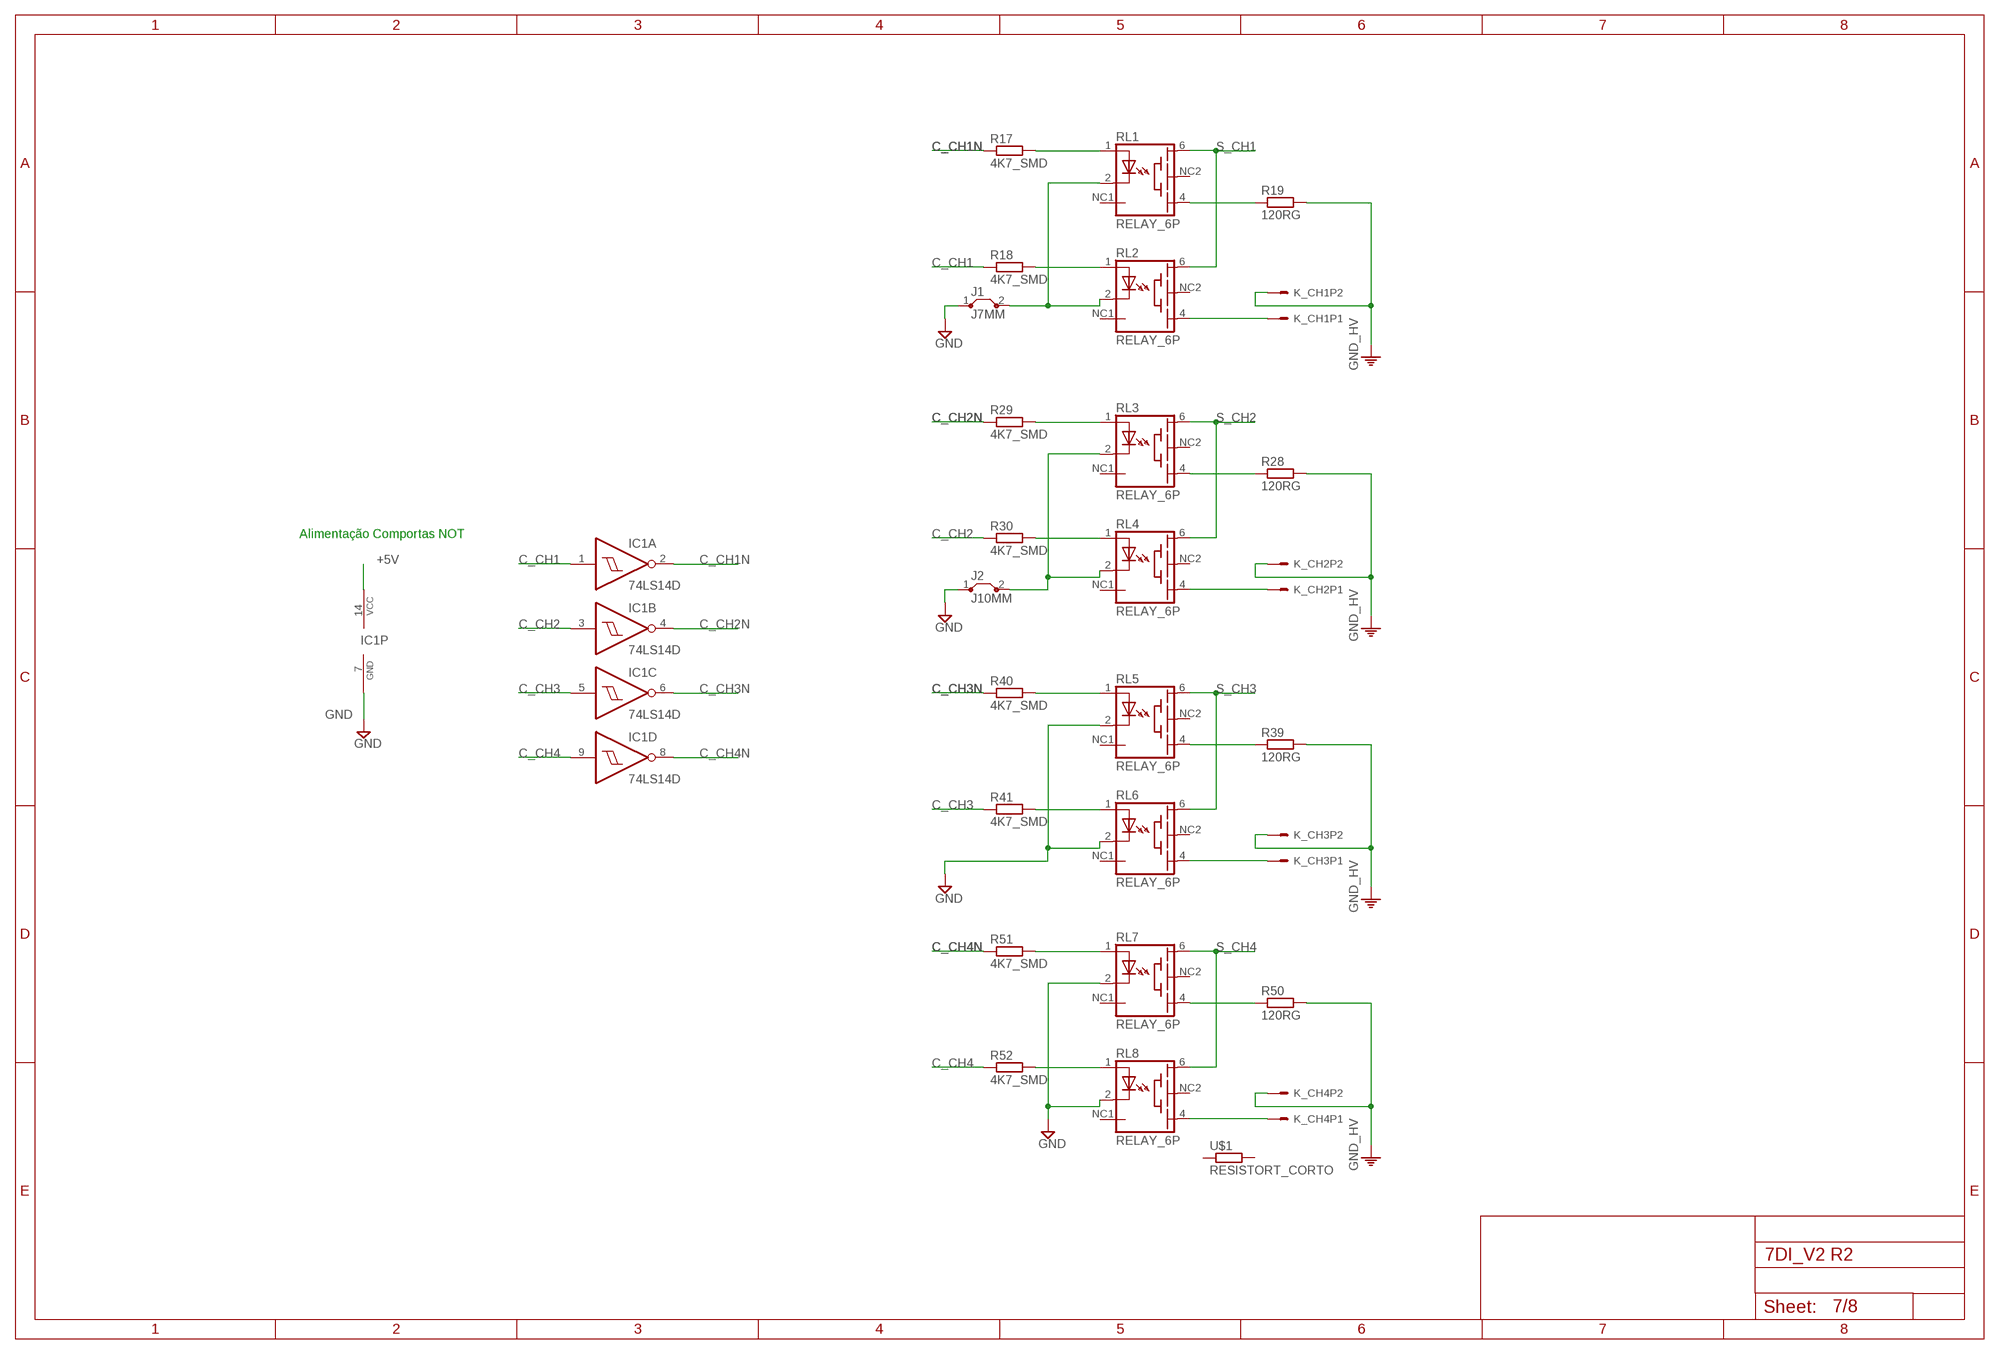
[diagram p6: schematic, sheet 7]

### Parts
IC1  74LS14D  [SO14NOT]
J1  J7MM  [07]
J2  J10MM  [10]
K_CH1  CONECTOR_5.08  [CONECTOR_X2_5.08]
K_CH2  CONECTOR_5.08  [CONECTOR_X2_5.08]
K_CH3  CONECTOR_5.08  [CONECTOR_X2_5.08]
K_CH4  CONECTOR_5.08  [CONECTOR_X2_5.08]
R17  4K7_SMD  RESISTORSMD_0805  [RESISTENCIA_0805]
R18  4K7_SMD  RESISTORSMD_0805  [RESISTENCIA_0805]
R19  120RG  RESISTORT_GRANDE  [0617V]
R28  120RG  RESISTORT_GRANDE  [0617V]
R29  4K7_SMD  RESISTORSMD_0805  [RESISTENCIA_0805]
R30  4K7_SMD  RESISTORSMD_0805  [RESISTENCIA_0805]
R39  120RG  RESISTORT_GRANDE  [0617V]
R40  4K7_SMD  RESISTORSMD_0805  [RESISTENCIA_0805]
R41  4K7_SMD  RESISTORSMD_0805  [RESISTENCIA_0805]
R50  120RG  RESISTORT_GRANDE  [0617V]
R51  4K7_SMD  RESISTORSMD_0805  [RESISTENCIA_0805]
R52  4K7_SMD  RESISTORSMD_0805  [RESISTENCIA_0805]
RL1  RELAY_6P  [TS210]
RL2  RELAY_6P  [TS210]
RL3  RELAY_6P  [TS210]
RL4  RELAY_6P  [TS210]
RL5  RELAY_6P  [TS210]
RL6  RELAY_6P  [TS210]
RL7  RELAY_6P  [TS210]
RL8  RELAY_6P  [TS210]
U$1  RESISTORT_CORTO  [0204V]

### Nets
+5V: IC1.14(P:VCC) ; also sheet 1,2
C_CH1: IC1.1(A:I) R18.1 ; also sheet 2
C_CH1N: IC1.2(A:O) R17.1
C_CH2: IC1.3(B:I) R30.1 ; also sheet 2
C_CH2N: IC1.4(B:O) R29.1
C_CH3: IC1.5(C:I) R41.1 ; also sheet 2
C_CH3N: IC1.6(C:O) R40.1
C_CH4: IC1.9(D:I) R52.1 ; also sheet 2
C_CH4N: IC1.8(D:O) R51.1
GND: IC1.7(P:GND) J1.1 J2.1 RL5.2(C) RL6.2(C) RL7.2(C) RL8.2(C) ; also sheet 1,2
N$32: R17.2 RL1.1(A)
N$33: R18.2 RL2.1(A)
N$36: R19.1 RL1.4(EMI)
N$38: K_CH1.1 RL2.4(EMI)
N$52: R29.2 RL3.1(A)
N$53: R30.2 RL4.1(A)
N$54: R28.1 RL3.4(EMI)
N$55: K_CH2.1 RL4.4(EMI)
N$74: R40.2 RL5.1(A)
N$75: R41.2 RL6.1(A)
N$76: R39.1 RL5.4(EMI)
N$77: K_CH3.1 RL6.4(EMI)
N$94: R51.2 RL7.1(A)
N$95: R52.2 RL8.1(A)
N$96: R50.1 RL7.4(EMI)
N$97: K_CH4.1 RL8.4(EMI)
N$104: J1.2 RL1.2(C) RL2.2(C)
N$105: J2.2 RL3.2(C) RL4.2(C)
PE: K_CH1.2 K_CH2.2 K_CH3.2 K_CH4.2 R19.2 R28.2 R39.2 R50.2 ; supply symbol labelled GND_HV ; also sheet 1,2,3,4,5,6,8
S_CH1: RL1.6(BAS) RL2.6(BAS) ; also sheet 3
S_CH2: RL3.6(BAS) RL4.6(BAS) ; also sheet 4
S_CH3: RL5.6(BAS) RL6.6(BAS) ; also sheet 5
S_CH4: RL7.6(BAS) RL8.6(BAS) ; also sheet 6
Unconnected: IC1.10(E:O) IC1.11(E:I) IC1.12(F:O) IC1.13(F:I) RL1.NC1 RL1.NC2 RL2.NC1 RL2.NC2 RL3.NC1 RL3.NC2 RL4.NC1 RL4.NC2 RL5.NC1 RL5.NC2 RL6.NC1 RL6.NC2 RL7.NC1 RL7.NC2 RL8.NC1 RL8.NC2 U$1.1 U$1.2

### Notes on the sheet
- Alimentação Comportas NOT

## Sheet 8 of 8
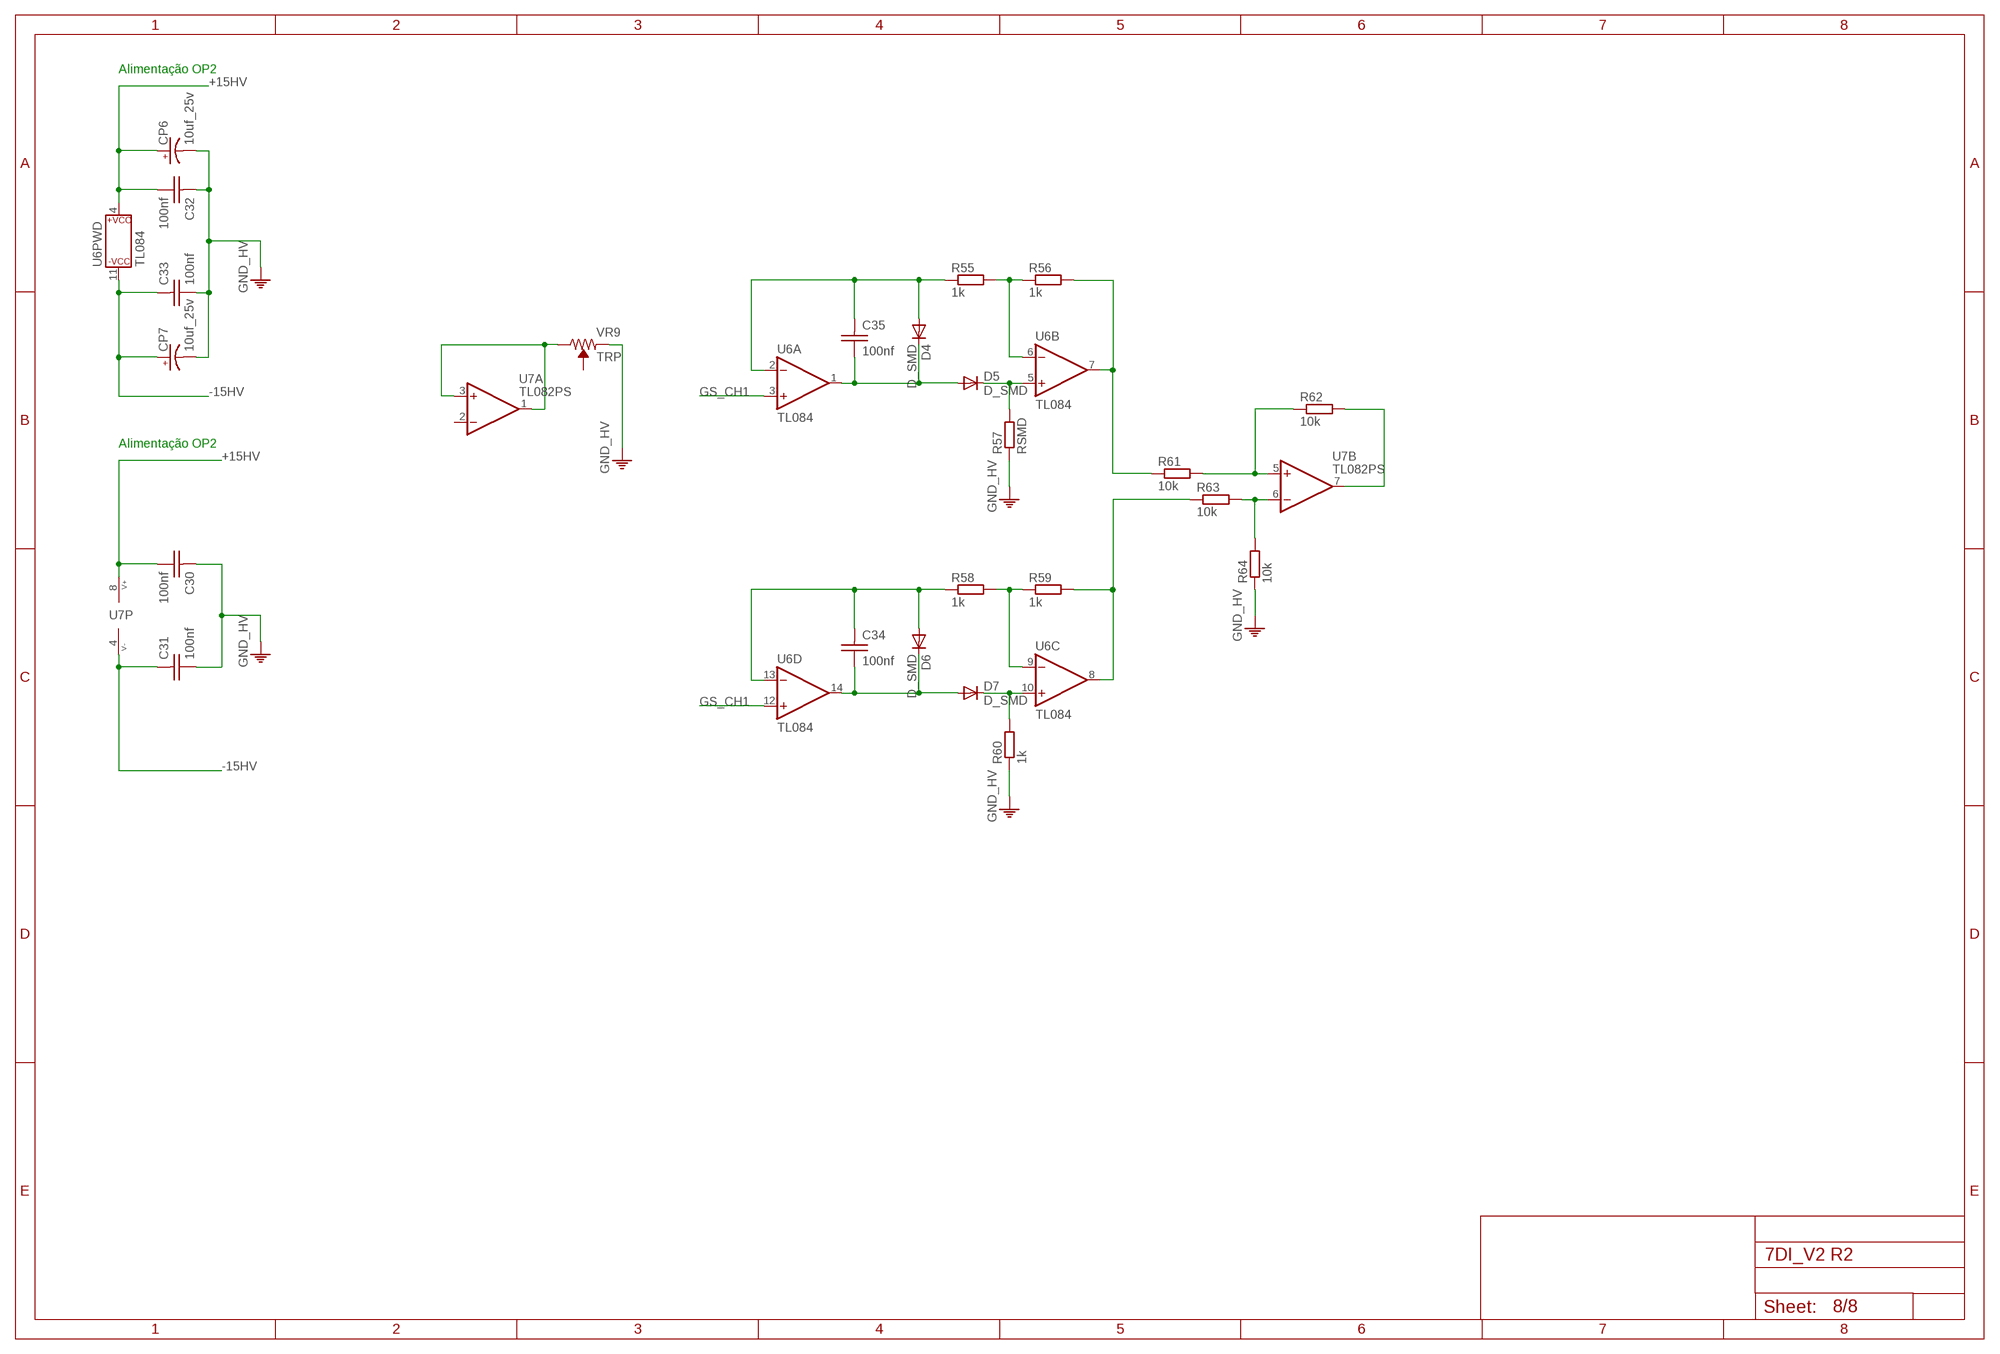
[diagram p7: schematic, sheet 8]

### Parts
C30  100nf  CAP_CERAMICO_SMD  [CAP_CER_SMD-0805]
C31  100nf  CAP_CERAMICO_SMD  [CAP_CER_SMD-0805]
C32  100nf  CAP_CERAMICO_SMD  [CAP_CER_SMD-0805]
C33  100nf  CAP_CERAMICO_SMD  [CAP_CER_SMD-0805]
C34  100nf  CAP_CERAMICO_SMD  [CAP_CER_SMD-0805]
C35  100nf  CAP_CERAMICO_SMD  [CAP_CER_SMD-0805]
CP6  10uf_25v  CAP_POLARIZADOCAP_T2,5-D5  [CAP_T_2,5-D5]
CP7  10uf_25v  CAP_POLARIZADOCAP_T2,5-D5  [CAP_T_2,5-D5]
D4  D_SMD  DIODOD_SMD  [D_SMD]
D5  D_SMD  DIODOD_SMD  [D_SMD]
D6  D_SMD  DIODOD_SMD  [D_SMD]
D7  D_SMD  DIODOD_SMD  [D_SMD]
R55  1k  RESISTORSMD_0805  [RESISTENCIA_0805]
R56  1k  RESISTORSMD_0805  [RESISTENCIA_0805]
R57  RSMD  RESISTORSMD_0805  [RESISTENCIA_0805]
R58  1k  RESISTORSMD_0805  [RESISTENCIA_0805]
R59  1k  RESISTORSMD_0805  [RESISTENCIA_0805]
R60  1k  RESISTORSMD_0805  [RESISTENCIA_0805]
R61  10k  RESISTORSMD_0805  [RESISTENCIA_0805]
R62  10k  RESISTORSMD_0805  [RESISTENCIA_0805]
R63  10k  RESISTORSMD_0805  [RESISTENCIA_0805]
R64  10k  RESISTORSMD_0805  [RESISTENCIA_0805]
U6  TL084  TL084_SMD  [SO14OP]
U7  TL082PS  [SOP08]
VR9  TRP  TRIMPOT_TH  [TRIMPOT-PTH-3386U]

### Nets
+15HV: C30.2 C32.2 CP6.+ U6.4(PWD:P$V+) U7.8(P:V+) ; also sheet 1,3,4,5,6
-15HV: C31.1 C33.1 CP7.+ U6.11(PWD:P$V-) U7.4(P:V-) ; also sheet 1,3,4,5,6
GS_CH1: U6.3(A:+IN) U6.12(D:+IN) ; also sheet 3
N$10: C35.2 D4.K(C) D5.A U6.1(A:OUT)
N$11: C35.1 D4.A R55.1 U6.2(A:-IN)
N$13: D5.K(C) R57.2 U6.5(B:+IN)
N$56: R55.2 R56.1 U6.6(B:-IN)
N$57: R56.2 R61.1 U6.7(B:OUT)
N$98: C34.2 D6.K(C) D7.A U6.14(D:OUT)
N$99: C34.1 D6.A R58.1 U6.13(D:-IN)
N$100: D7.K(C) R60.2 U6.10(C:+IN)
N$101: R58.2 R59.1 U6.9(C:-IN)
N$106: R59.2 R63.1 U6.8(C:OUT)
N$107: R61.2 R62.1 U7.5(B:+IN)
N$108: R62.2 U7.7(B:OUT)
N$109: R63.2 R64.2 U7.6(B:-IN)
N$110: U7.1(A:OUT) U7.3(A:+IN) VR9.3(CW)
PE: C30.1 C31.2 C32.1 C33.2 CP6.- CP7.- R57.1 R60.1 R64.1 VR9.1(CCW) ; supply symbol labelled GND_HV ; also sheet 1,2,3,4,5,6,7
Unconnected: U7.2(A:-IN) VR9.2(WIPER)

### Notes on the sheet
- Alimentação OP2
- Alimentação OP2

## Power pins joined to a net without a drawn wire
3.3V: UC1.3.3V

## Library data of the parts
C1-C35 = 7DI Library:CAP_CERAMICO: Capacitores ceramicos y de poliester, entre otros
CON_AC = 7DI Library:CONECTOR_ACELEROMETRO_MPU6050: Conector para el Acelerometro MPU6050 I2C
CP1-CP7 = 7DI Library:CAP_POLARIZADO: Capacitor para el dac de 2.2uf
D1-D7 = 7DI Library:DIODO: Diodo usado para protecion en las fuentes de alimentacion
DAC1 = 7DI Library:DAC124S085: DAC124S085 4 output 12bit DAC Mfg.: TI, Mfg_Part_No.:DAC124S085CIMM/NOPB, Digikey Part No.; DAC124S085CIMM/NOPBTR-ND, Pkg.: TFSOP-10, MSOP-10, VSSOP-10 Datasheet: http://www.ti.com/lit/ds/symlink/dac124s085.pdf
IC1 = 7DI Library:74*14: Hex schmitt trigger INVERTER
J1 J2 = 7DI Library:J: Bridge
K1 = 7DI Library:CONECTOR_BTHC-06: CONECTOR DEL MODULO BLUETOOTH HC-06
K2 = 7DI Library:CONECTOR_: Diferentes tipos de conectores; SPICEPREFIX: X
K3-K6 K_CH1-K_CH4 = 7DI Library:CONECTOR_: Diferentes tipos de conectores
LED1-LED3 = 7DI Library:LED: Diodo led de 3, 5 mm y SMD 0805
Q1 Q6-Q9 Q14-Q17 Q22-Q25 Q30-Q32 = 7DI Library:TIP48: NPN TRANSISTOR
Q2-Q5 Q10-Q13 Q18-Q21 Q26-Q29 = 7DI Library:TIP50: PNP TRANSISTOR
R1-R64 U$1 = 7DI Library:RESISTOR: Resistor con varias variantes
REG1 REG3 = 7DI Library:REGULADOR_78XX
REG2 = 7DI Library:REGULADOR_LM4132_4.1_SMD: Regulador de alta precision LM4132-4.096
RL1-RL8 = 7DI Library:RELAY_: Rele de estado solido
U1 U3-U6 = 7DI Library:TL084: IC TL084 Quad Op Amp; PROD_ID: U
U2 = 7DI Library:ISO7240_SMD: ISO7240 High Speed Quad Digital Isolators
U7 = 7DI Library:TL082: JFET OP-AMP - Dual
UC1 = 7DI Library:TEENSY_3.0_A_3.2: Unidade de controle baseada em Teensy 3.x
VR1-VR9 = 7DI Library:TRIMPOT: Trimming Potentiometer (Trimpot); PROD_ID: ''; SF_SKU: ''

## Board
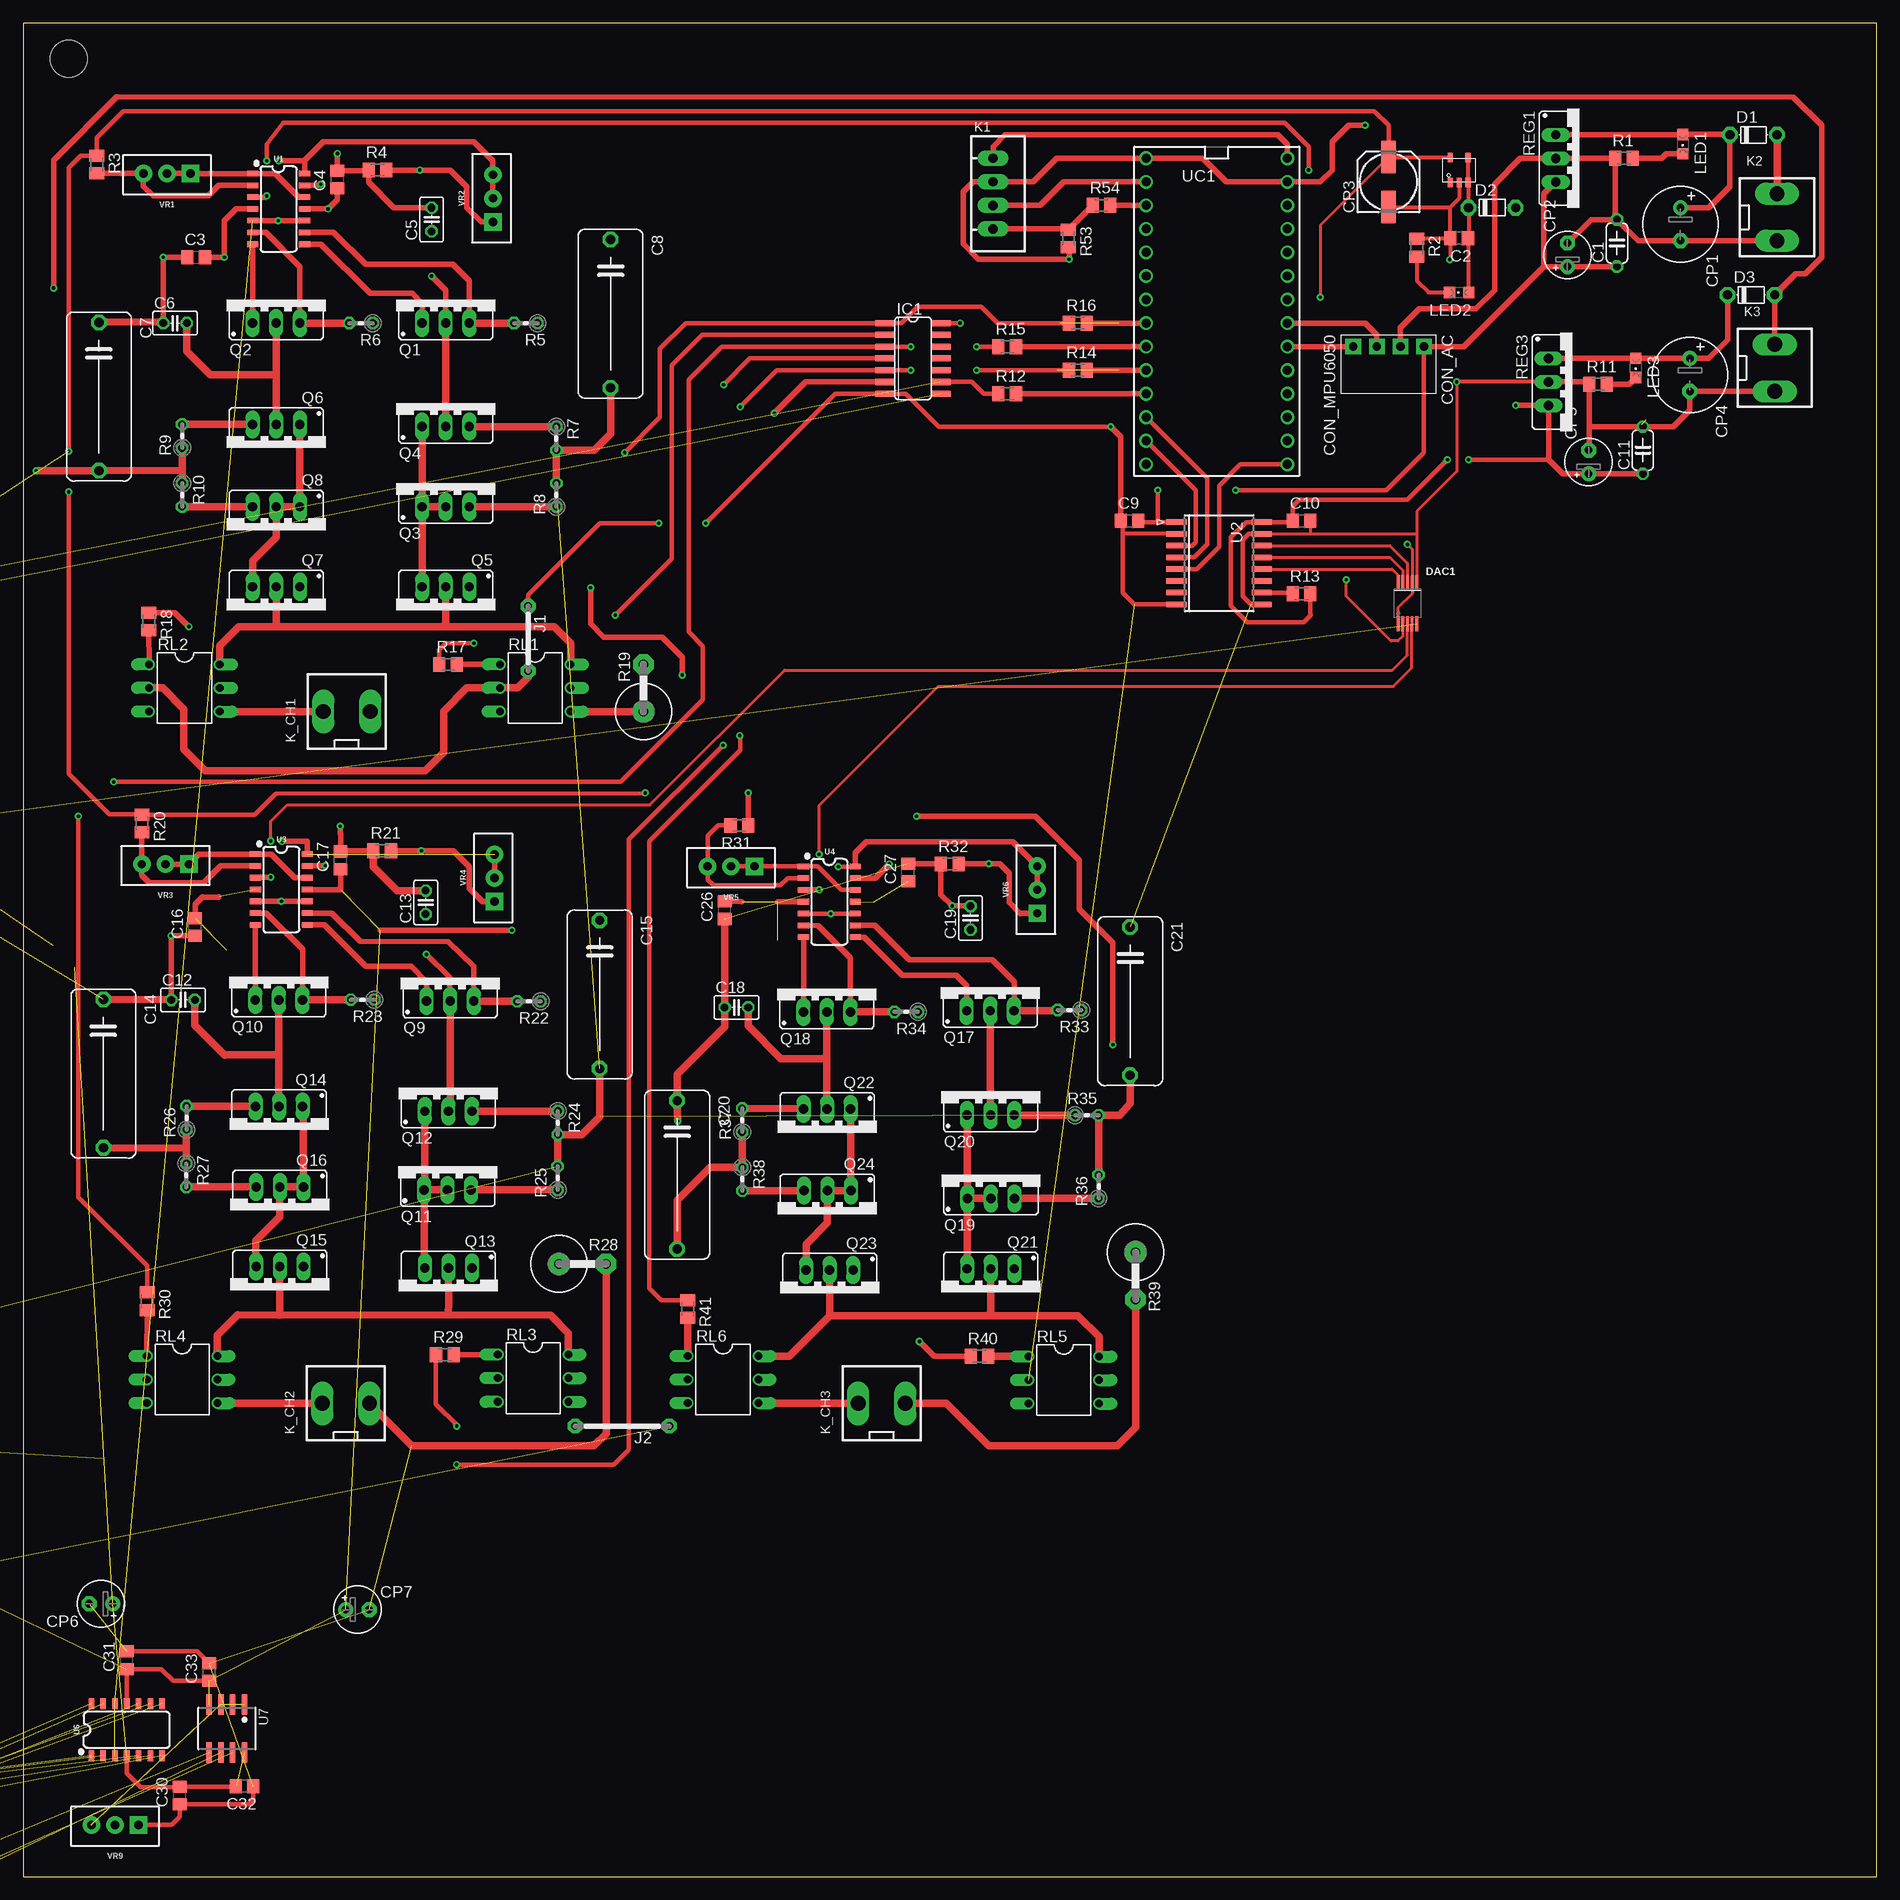
[diagram p8: board, top side]
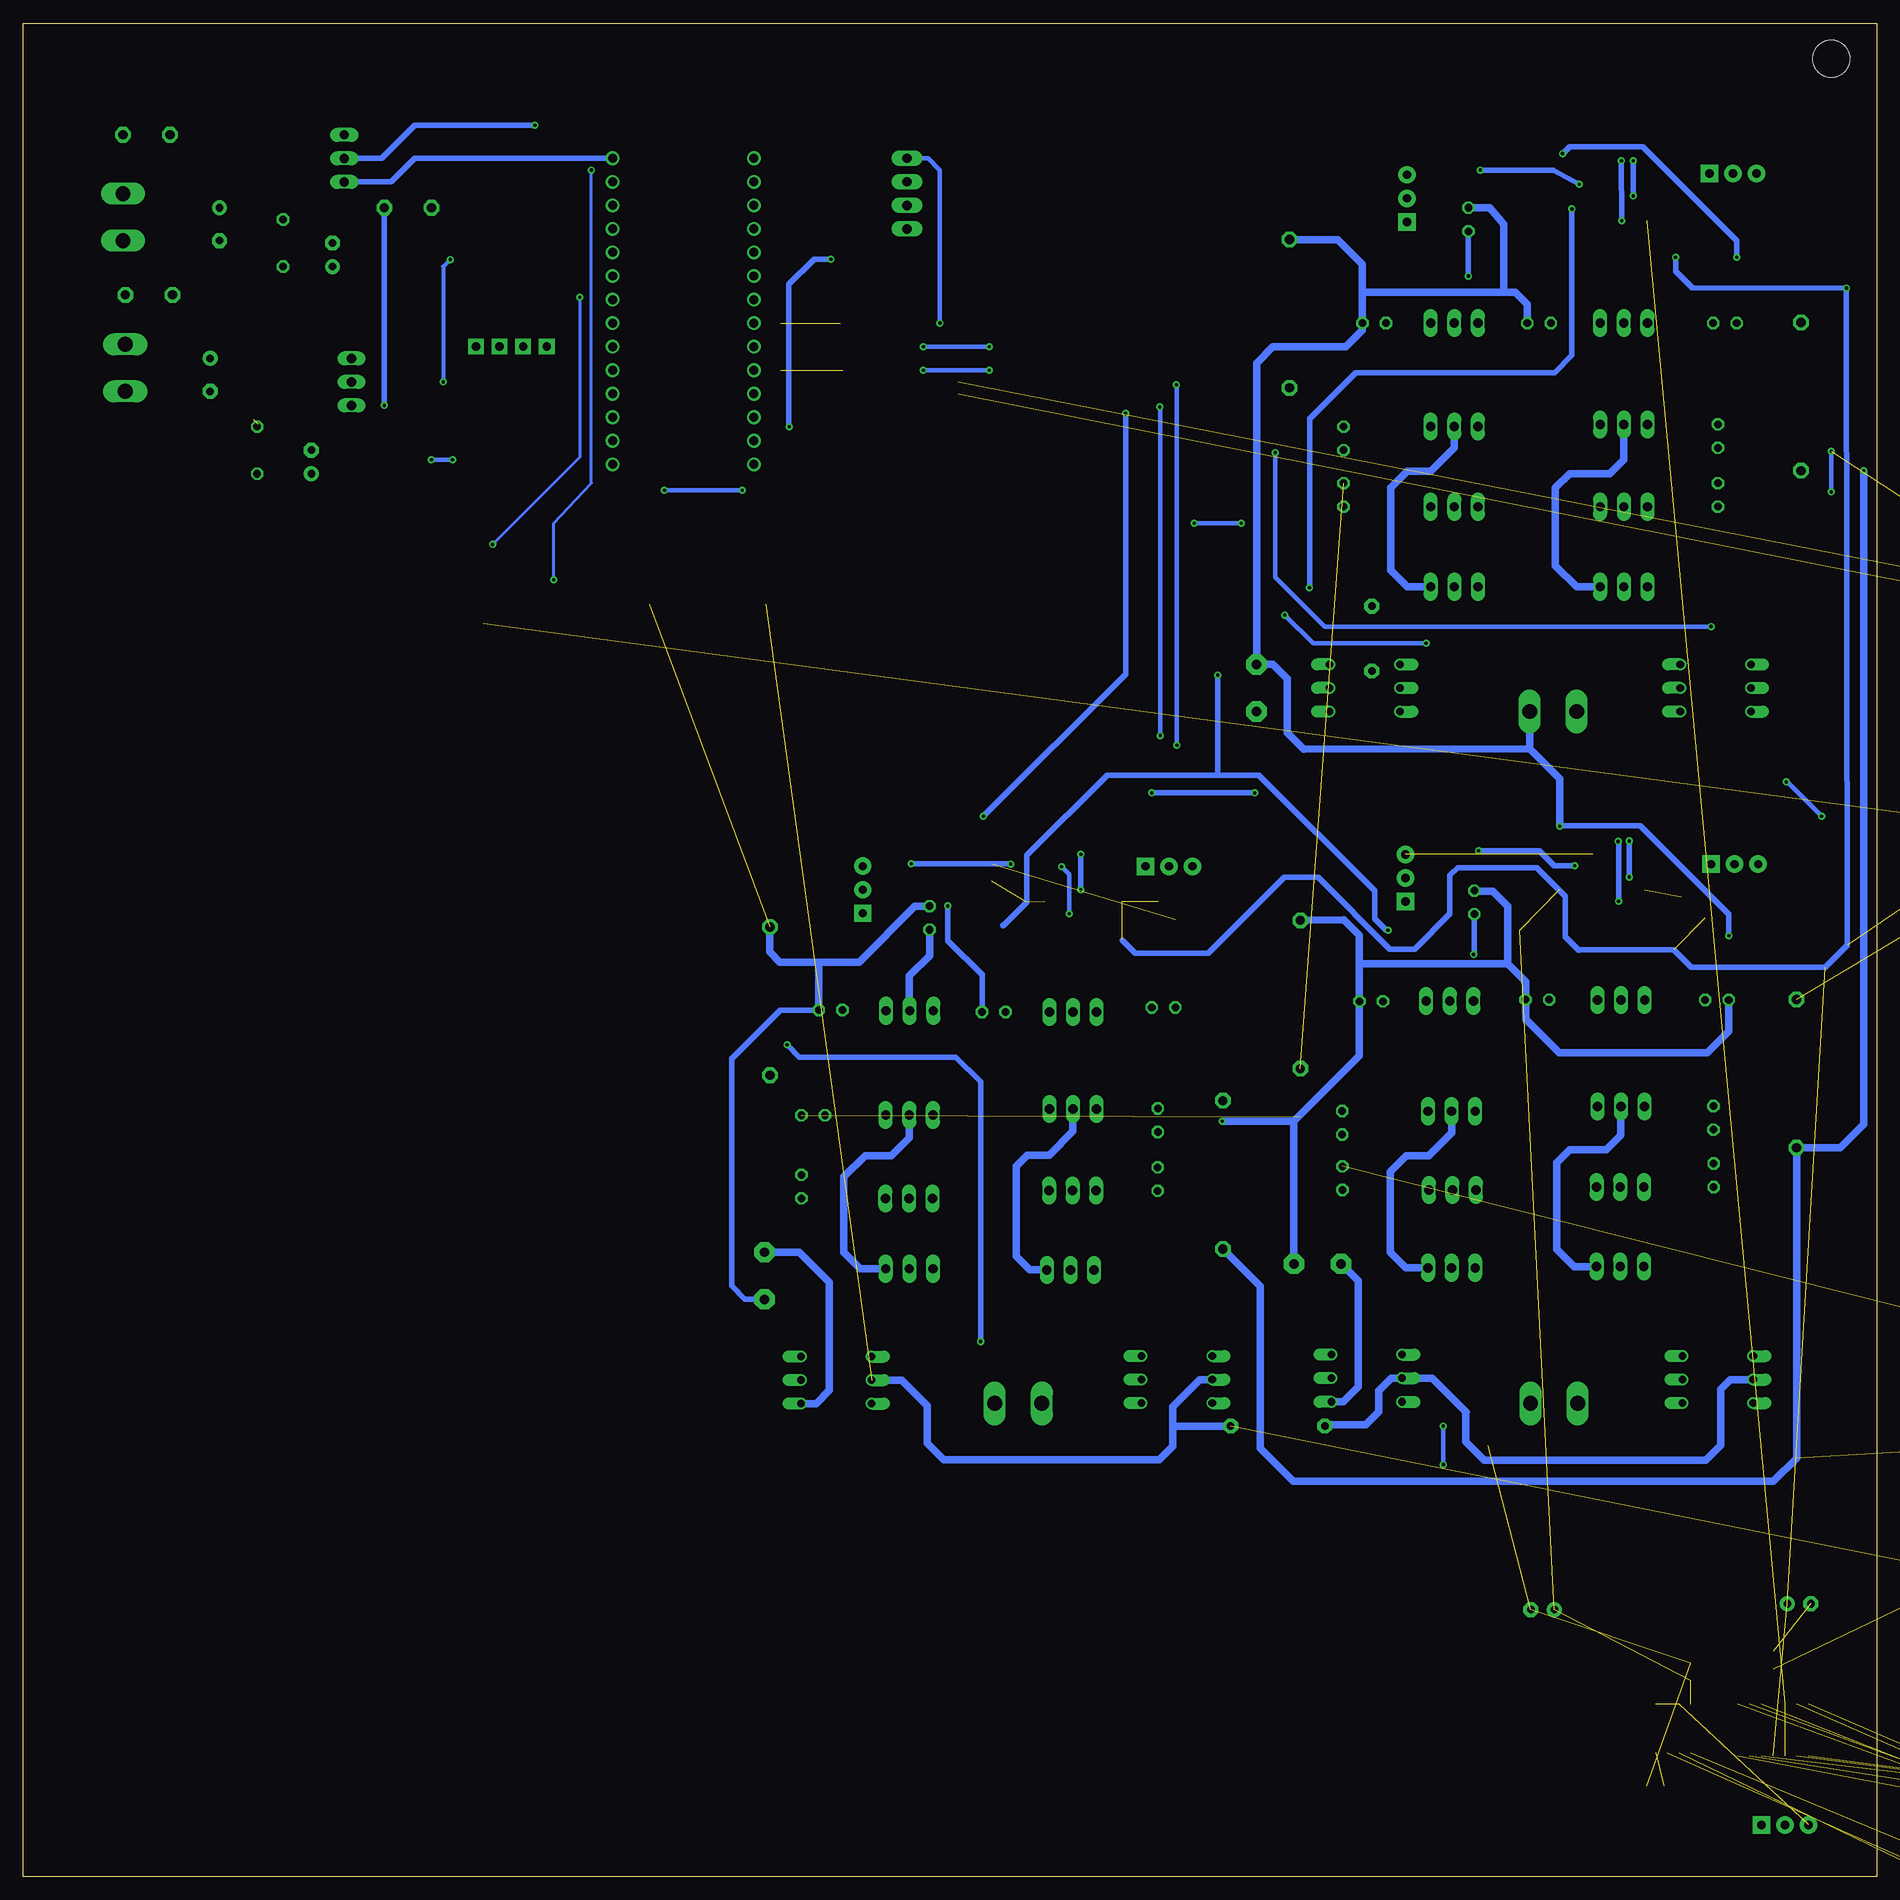
[diagram p9: board, bottom side, seen from below]

Size 200 x 200 mm. Coordinates in mm from the lower left corner, seen from the top.
Outline: 0,0 200,0 200,200 0,200 0,0
Copper layers (1*16): Top 0.035mm / dielectric 1.5mm / Bottom 0.035mm
Design rules "default": minimum track width 6mil, minimum drill 0.35mm, track to track 6mil, track to pad 6mil, pad to pad 6mil, via to via 6mil, smd to smd 6mil, copper to edge 40mil, drill to drill 6mil, minimum pad ring 10mil, minimum via ring 8mil, stop-mask expansion 4mil, vias tented up to drill 0mil, thermal gap 10mil
Holes 4 mm at 4.93,196.16

### Footprints (pad centres in the part's own frame; a part is rotated, then mirrored left to right if it is on the bottom)
CAP_CER_5,08-024X044 = drill 0.813 octagon: 1 -2.54,0; 2 2.54,0
CAP_CER_SMD-0805 = smd 1.3 x 1.5: 1 -0.95,0; 2 0.95,0
CAP_CER_2,54-5X5 = drill 0.813 octagon: 1 -1.27,0; 2 1.27,0
CAP_CER_16X7 = drill 1 pad 1.676 octagon: 1 -8,0; 2 8,0
MPU6050 = drill 0.9 pad 1.676 square: GND -2.54,0; SCL -2.54,-2.54; SDA -2.54,-5.08; VIN -2.54,2.54
CAP_T_3,5-D8 = drill 0.813 pad 1.6: + -1.778,0 | drill 0.813 pad 1.6 octagon: - 1.778,0
CAP_T_2,5-D5 = drill 0.813 pad 1.6: + -1.27,0 | drill 0.813 pad 1.6 octagon: - 1.27,0
153CLV-0605 = smd 3.5 x 1.6: + 2.7,0; - -2.7,0
D-5 = drill 1 pad 1.676 octagon: A 2.54,0; C -2.54,0
D_SMD = smd 0.813 x 1.676: A 1.8,0; K -1.8,0
DAC_SO10 = smd 0.3 x 1.6: 1 -1,-2.2; 2 -0.5,-2.2; 3 0,-2.2; 4 0.5,-2.2; 5 1,-2.2; 6 1,2.2; 7 0.5,2.2; 8 0,2.2; 9 -0.5,2.2; 10 -1,2.2
SO14NOT = smd 0.66 x 2.032: 1 -3.81,-3.073; 2 -2.54,-3.073; 3 -1.27,-3.073; 4 0,-3.073; 5 1.27,-3.073; 6 2.54,-3.073; 7 3.81,-3.073; 8 3.81,3.073; 9 2.54,3.073; 10 1.27,3.073; 11 0,3.073; 12 -1.27,3.073; 13 -2.54,3.073; 14 -3.81,3.073
07 = drill 0.813 pad 1.6 octagon: 1 -3.5,0; 2 3.5,0
10 = drill 0.813 pad 1.6 octagon: 1 -5.08,0; 2 5.08,0
CONECTOR_BTHC-06 = drill 1 pad 1.676 long: 1 -3.81,0; 2 -1.27,0; 3 1.27,0; 4 3.81,0
CONECTOR_X2_5.08 = drill 1.6 pad 2.184 long: 1 -2.54,0; 2 2.54,0
LED_0805 = smd 1.2 x 1.2: A 0,-1.05; C 0,1.05
TO220 = drill 1.016 long: B -2.54,0; C 0,0; E 2.54,0
RESISTENCIA_0805 = smd 1.3 x 1.6: 1 -0.95,0; 2 0.95,0
0204V = drill 0.813 octagon: 1 -1.27,0; 2 1.27,0
0617V = drill 1.016 pad 2.184 octagon: 1 -2.54,0; 2 2.54,0
78XXS = drill 1.016 long: GND 0,-2.54; IN -2.54,-2.54; OUT 2.54,-2.54
SOT23 = smd 0.55 x 1: 1 -0.95,-1.35; 2 0,-1.35; 3 0.95,-1.35; 4 0.95,1.35; 5 -0.95,1.35
TS210 = drill 0.813 offset: 1 -2.54,-3.81; 2 0,-3.81; 4 2.54,3.81; 6 -2.54,3.81; NC1 2.54,-3.81; NC2 0,3.81
SO14OP = smd 0.6 x 1.2: 1 -3.175,-2.8; 2 -1.905,-2.8; 3 -0.635,-2.8; 4 0.635,-2.8; 5 1.905,-2.8; 6 3.175,-2.8; 7 4.445,-2.8; 8 4.445,2.8; 9 3.175,2.8; 10 1.905,2.8; 11 0.635,2.8; 12 -0.635,2.8; 13 -1.905,2.8; 14 -3.175,2.8
SO-16DW = smd 0.6 x 2.2: 1 -4.445,-4.6; 2 -3.175,-4.6; 3 -1.905,-4.6; 4 -0.635,-4.6; 5 0.635,-4.6; 6 1.905,-4.6; 7 3.175,-4.6; 8 4.445,-4.6; 9 4.445,4.6; 10 3.175,4.6; 11 1.905,4.6; 12 0.635,4.6; 13 -0.635,4.6; 14 -1.905,4.6; 15 -3.175,4.6; 16 -4.445,4.6
SOP08 = smd 0.6 x 2.2: 1 -1.905,-2.6; 2 -0.635,-2.6; 3 0.635,-2.6; 4 1.905,-2.6; 5 1.905,2.6; 6 0.635,2.6; 7 -0.635,2.6; 8 -1.905,2.6
TEENSY_3.0-3.2_DIL = drill 0.965: 0 -7.62,13.97; 1 -7.62,11.43; 2 -7.62,8.89; 3 -7.62,6.35; 3.3V 7.62,11.43; 4 -7.62,3.81; 5 -7.62,1.27; 6 -7.62,-1.27; 7 -7.62,-3.81; 8 -7.62,-6.35; 9 -7.62,-8.89; 10 -7.62,-11.43; 11 -7.62,-13.97; 12 -7.62,-16.51; 13 7.62,-16.51; 14/A0 7.62,-13.97; 15/A1 7.62,-11.43; 16/A2 7.62,-8.89; 17/A3 7.62,-6.35; 18/A4 7.62,-3.81; 19/A5 7.62,-1.27; 20/A6 7.62,1.27; 21/A7 7.62,3.81; 22/A8 7.62,6.35; 23/A9 7.62,8.89; AGND 7.62,13.97; GND -7.62,16.51; VIN 7.62,16.51
TRIMPOT-PTH-3386U = drill 0.9 pad 1.88 square: 1 -2.54,-0.015 | drill 0.9 pad 1.88: 2 0,-0.015; 3 2.54,-0.015

### Placement (x,y rotation side)
C1  171.96,176.28 90 top
C2  154.94,176.78 180 top
C3  18.67,174.75 0 top
C4  33.91,183.13 90 top
C5  44.07,178.82 90 top
C6  16.38,167.64 0 top
C7  8.18,159.72 270 top
C8  63.37,168.66 270 top
C9  119.38,146.3 0 top
C10  137.92,146.3 0 top
C11  174.75,153.92 90 top
C12  17.25,94.61 0 top
C13  43.43,105.13 90 top
C14  8.66,86.66 270 top
C15  62.2,95.2 270 top
C16  18.54,102.46 90 top
C17  34.24,109.68 90 top
C18  76.96,93.8 0 top
C19  102.21,103.45 90 top
C20  70.56,75.74 270 top
C21  119.43,94.49 270 top
C22  -20.07,112.65 0 top  (outside the outline)
C23  -26.42,112.65 0 top  (outside the outline)
C24  -45.47,47.88 0 top  (outside the outline)
C25  -64.52,47.88 0 top  (outside the outline)
C26  75.69,104.29 90 top
C27  95.48,108.36 90 top
C28  -45.47,132.97 0 top  (outside the outline)
C29  -51.82,132.97 0 top  (outside the outline)
C30  16.89,8.76 90 top
C31  11.18,23.37 90 top
C32  23.88,9.78 180 top
C33  20.07,22.1 90 top
C34  -149.86,-47.75 0 top  (outside the outline)
C35  -147.07,-6.99 0 top  (outside the outline)
CON_AC  148.59,162.56 270 top
CP1  178.82,178.31 270 top
CP2  166.62,175.01 90 top
CP3  147.32,182.88 90 top
CP4  179.83,162.05 270 top
CP5  168.91,152.65 90 top
CP6  8.38,29.46 180 top
CP7  36.07,28.83 0 top
D1  186.69,187.96 0 top
D2  158.5,180.09 0 top
D3  186.44,170.69 0 top
D4  -151.51,-7.24 0 top  (outside the outline)
D5  -156.21,-7.24 0 top  (outside the outline)
D6  -143.76,-47.37 0 top  (outside the outline)
D7  -156.21,-53.59 0 top  (outside the outline)
DAC1  149.35,137.41 0 top
IC1  96.01,163.83 270 top
J1  54.48,133.6 270 top
J2  64.64,48.64 180 top
K1  104.65,181.61 270 top
K2  189.23,179.07 270 top
K3  188.98,162.81 270 top
K4  -63.25,59.31 0 top  (outside the outline)
K5  -74.68,59.31 0 top  (outside the outline)
K6  -86.11,59.31 0 top  (outside the outline)
K_CH1  34.92,125.73 0 top
K_CH2  34.82,51.08 0 top
K_CH3  92.63,51.08 0 top
K_CH4  -40.39,59.31 0 top  (outside the outline)
LED1  179.07,186.94 180 top
LED2  154.94,170.94 90 top
LED3  173.99,162.81 180 top
Q1  45.59,167.64 0 top
Q2  27.3,167.64 0 top
Q3  45.59,147.83 0 top
Q4  45.59,156.46 0 top
Q5  45.59,139.19 180 top
Q6  27.3,156.72 180 top
Q7  27.3,139.19 180 top
Q8  27.3,147.83 180 top
Q9  46.08,94.49 0 top
Q10  27.58,94.59 0 top
Q11  45.8,74.12 0 top
Q12  45.87,82.6 0 top
Q13  45.87,65.71 180 top
Q14  27.61,83.13 180 top
Q15  27.69,65.84 180 top
Q16  27.69,74.45 180 top
Q17  104.34,93.45 0 top
Q18  86.72,93.29 0 top
Q19  104.42,73.2 0 top
Q20  104.39,82.19 0 top
Q21  104.39,65.61 180 top
Q22  86.74,82.83 180 top
Q23  87.02,65.48 180 top
Q24  86.77,74.04 180 top
Q25  -79.76,89.79 0 top  (outside the outline)
Q26  -91.19,89.79 0 top  (outside the outline)
Q27  -102.62,89.79 0 top  (outside the outline)
Q28  -114.05,89.79 0 top  (outside the outline)
Q29  -125.48,89.79 0 top  (outside the outline)
Q30  -22.61,98.68 0 top  (outside the outline)
Q31  -34.04,98.68 0 top  (outside the outline)
Q32  -45.47,98.68 0 top  (outside the outline)
R1  172.72,185.42 0 top
R2  150.37,175.77 270 top
R3  7.95,184.73 270 top
R4  38.23,184.15 0 top
R5  54.23,167.64 180 top
R6  36.45,167.64 180 top
R7  57.53,155.19 270 top
R8  57.53,149.1 90 top
R9  17.14,155.45 90 top
R10  17.14,149.1 270 top
R11  169.93,161.04 0 top
R12  106.17,160.02 0 top
R13  137.92,138.43 0 top
R14  113.79,162.56 0 top
R15  106.17,165.1 0 top
R16  113.79,167.64 0 top
R17  45.85,130.81 0 top
R18  13.56,135.46 270 top
R19  66.93,128.27 90 top
R20  12.83,113.67 270 top
R21  38.73,110.72 0 top
R22  54.56,94.46 180 top
R23  36.63,94.64 180 top
R24  57.68,81.36 270 top
R25  57.66,75.39 90 top
R26  17.63,81.89 90 top
R27  17.6,75.69 270 top
R28  60.35,66.14 0 top
R29  45.49,56.34 0 top
R30  13.39,62.1 270 top
R31  77.27,113.44 180 top
R32  99.97,109.27 0 top
R33  112.88,93.52 180 top
R34  95.28,93.32 180 top
R35  114.76,82.17 0 top
R36  116.03,74.47 90 top
R37  77.57,81.64 90 top
R38  77.6,75.29 270 top
R39  120.02,64.85 270 top
R40  103.17,56.16 0 top
R41  71.7,61.26 270 top
R42  -45.47,120.27 0 top  (outside the outline)
R43  -55.63,120.27 0 top  (outside the outline)
R44  -110.24,139.32 0 top  (outside the outline)
R45  -115.32,139.32 0 top  (outside the outline)
R46  -120.4,139.32 0 top  (outside the outline)
R47  -125.48,139.32 0 top  (outside the outline)
R48  -130.56,139.32 0 top  (outside the outline)
R49  -135.64,139.32 0 top  (outside the outline)
R50  -89.92,112.65 0 top  (outside the outline)
R51  -68.33,126.62 0 top  (outside the outline)
R52  -77.22,126.62 0 top  (outside the outline)
R53  112.78,176.78 270 top
R54  116.33,180.34 0 top
R55  -156.46,-13.21 0 top  (outside the outline)
R56  -156.46,-19.43 0 top  (outside the outline)
R57  -156.46,-25.65 0 top  (outside the outline)
R58  -156.46,-41.53 0 top  (outside the outline)
R59  -149.86,-41.53 0 top  (outside the outline)
R60  -156.46,-47.75 0 top  (outside the outline)
R61  -156.46,-59.56 0 top  (outside the outline)
R62  -156.46,-65.79 0 top  (outside the outline)
R63  -156.46,-72.01 0 top  (outside the outline)
R64  -156.46,-78.23 0 top  (outside the outline)
REG1  167.89,185.42 270 top
REG2  154.94,184.15 0 top
REG3  167.13,161.29 270 top
RL1  55.24,128.27 270 top
RL2  17.4,128.27 270 top
RL3  55.02,53.8 270 top
RL4  17.14,53.64 270 top
RL5  112.27,53.59 270 top
RL6  75.51,53.64 270 top
RL7  -105.92,47.88 0 top  (outside the outline)
RL8  -22.61,33.91 0 top  (outside the outline)
U1  27.56,180.59 270 top
U2  129.03,141.73 270 top
U3  27.86,107.16 270 top
U4  87,105.84 270 top
U5  -96.27,105.03 0 top  (outside the outline)
U6  10.54,15.88 0 top
U7  21.97,16 180 top
U$1  -150.62,-87.88 0 top  (outside the outline)
UC1  128.78,168.91 0 top
VR1  15.52,183.77 180 top
VR2  50.67,181.1 90 top
VR3  15.34,109.25 180 top
VR4  50.85,107.77 90 top
VR5  76.38,109.02 180 top
VR6  109.4,106.5 90 top
VR7  -21.34,105.03 0 top  (outside the outline)
VR8  -31.5,105.03 0 top  (outside the outline)
VR9  9.91,5.59 180 top

### Tracks (layer width: path | path; a pad name or v marks a point on that pad's centre or on a via)
!SYNC
  Top 0.508: UC1.10 127.76,150.88 127.76,143.76 126.36,142.37 U2.4
!SYNC_ISO
  Top 0.305: U2.13 147.45,142.37 148.85,140.96 DAC1.9
+5_ISO  (via drill 0.35)
  Top 0.508: R13.2 138.87,136.21 138.94,136.14 138.18,135.38 132.08,135.38 130.3,137.16 130.3,144.53 131.95,146.18 U2.16 136.84,146.18 C10.1 136.97,147.89 137.67,148.59 149.35,148.59 v153.67,152.91 | v155.96,152.91 164.59,152.91
  Top 0.61: C11.1 CP5.+ 166.12,151.38 164.59,152.91 REG3.OUT v161.04,158.75
  Bottom 0.508: v153.67,152.91 v155.96,152.91
  Bottom 0.61: v161.04,158.75 D2.A
+5V  (via drill 0.35)
  Top 0.508: v101.09,167.64 IC1.14 | U2.1 122.43,146.18 | 122.43,146.18 120.46,146.18 C9.2 | CON_AC.VIN 151.13,153.67 147.07,149.61 v130.81,149.61 | v122.43,149.61 122.43,146.18
  Top 0.61: C1.1 CP2.+ 164.08,173.74 | REG1.OUT 164.08,181.61 164.08,173.74 | CON_AC.VIN 155.45,165.1 164.08,173.74 | K1.1 104.65,186.69 105.92,187.96 135.38,187.96 136.4,186.94 UC1.VIN
  Bottom 0.508: K1.1 102.36,185.42 101.09,184.15 v101.09,167.64 | v130.81,149.61 v122.43,149.61
  Bottom 0.61: REG1.OUT 160.27,182.88 157.73,185.42 UC1.VIN
+15HV  (via drill 0.35)  (9 unrouted)
  Top 0.508: 22.99,9.84 C32.2 22.86,9.71 C30.2 16.83,9.65 12.7,9.65 11.18,11.18 U6.4
  Top 0.61: K3.1 D3.A 191.26,172.97 192.28,172.97 194.06,174.75 194.06,188.98 191.01,192.02 10.11,192.05 3.28,185.22 v3.28,171.43 | U1.4 22.99,179.96 21.72,178.69 v21.72,174.75 C3.2 | 21.11,105.74 21.11,105.72 19.41,105.72 19.36,105.77 18.54,104.95 C16.2 | U4.4 81.43,105.21 | 77.54,105.23 C26.2
  Bottom 0.508: 32.16,100 32.13,100.03
  Bottom 0.61: 81.41,101.04 80.03,99.67 72.11,99.67 63.96,107.82 60.25,107.82 52.53,100.1 49.86,100.1 46.08,103.89 46.08,108.05 45.24,108.89 36.68,108.89 33.6,105.82 33.6,101.45 32.16,100 | 32.13,100.03 21.89,100.03 20.02,98.15 5.56,98.12 3.2,100.51 v3.28,171.43 19.94,171.45 21.72,173.23 v21.72,174.75
+15V
  Top 0.813: K2.1 D1.A
-15HV  (via drill 0.35)  (9 unrouted)
  Top 0.508: U6.11 C31.1 14.92,22.42 16.19,21.15 C33.1
  Top 0.61: v61.21,139.09 61.21,135.2 62.66,133.76 68.96,133.76 71.12,131.6 v71.12,129.67 | v52.73,102.13 38.51,102.13 | C4.1 33.91,180.97 v32.89,179.96 U1.11 | U3.11 34.27,106.53 34.27,108.7 C17.1
  Bottom 0.61: v61.21,139.09 61.19,139.09 61.19,157.33 56.21,162.31 34.77,162.31 32.92,164.16 32.92,179.93 v32.89,179.96 | 71.12,118.87 v71.12,129.67 | v52.73,102.13 52.93,102.13 54.18,103.38 54.18,106.38 66.67,118.87 71.12,118.87 | 94.28,102.67 94.23,102.62 91.69,105.16 91.69,110.24 83.06,118.87 71.12,118.87
C_CH1  (via drill 0.35)
  Top 0.508: R16.1 105.16,167.64 103.38,169.42 96.52,169.42 94.74,167.64 IC1.1 71.5,167.64 68.71,164.85 68.71,157.48 v64.9,153.67
  Top 0.61: R18.1 16.37,136.41 v17.88,134.9
  Bottom 0.508: v17.88,134.9 59.56,134.87 64.9,140.21 v64.9,153.67
C_CH1N  (via drill 0.35)
  Top 0.508: R17.1 44.9,132.4 45.59,133.1 v48.64,133.1 | IC1.2 73.28,166.37 69.98,163.07 69.98,142.24 v63.88,136.14
  Bottom 0.508: v48.64,133.1 60.83,133.1 v63.88,136.14
C_CH2  (via drill 0.35)
  Top 0.508: R15.1 v102.87,165.1 | v95.76,165.1 IC1.3 75.36,165.1 71.81,161.54 71.81,134.31 73.33,132.79 73.33,127 64.47,118.14 v9.78,118.14 | R30.1 13.39,65.91 5.97,73.33 v5.97,114.43
  Bottom 0.508: v102.87,165.1 v95.76,165.1 | v5.97,114.43 9.68,118.14 v9.78,118.14
C_CH2N  (via drill 0.35)
  Top 0.508: R29.1 44.54,51.01 46.89,48.67 46.81,48.67 v46.79,48.64 | v46.76,44.48 63.73,44.48 65.35,46.1 65.35,111.94 v75.51,122.1 | v75.56,160.99 78.41,163.83 IC1.4
  Bottom 0.508: v46.79,48.64 46.79,44.5 v46.76,44.48 | v75.51,122.1 75.51,160.93 v75.56,160.99
C_CH3  (via drill 0.35)
  Top 0.508: R14.1 v102.87,162.56 | v95.76,162.56 IC1.5 81.33,162.56 v77.37,158.6 | R41.1 68.82,62.22 67.54,63.5 67.54,111.73 77.37,121.56 77.37,123.09 v77.32,123.14
  Bottom 0.508: v102.87,162.56 v95.76,162.56 | v77.32,123.14 77.32,158.55 v77.37,158.6
C_CH3N  (via drill 0.35)
  Top 0.61: R40.1 98.3,56.16 v96.7,57.76 | v117.58,89.76 117.58,100.76 113.94,104.39 113.94,109.7 109.22,114.43 v96.39,114.43 | v81.05,157.89 84.45,161.29 IC1.6
  Bottom 0.61: v96.7,57.76 96.7,85.78 99.36,88.44 116.26,88.44 v117.58,89.76 | v96.39,114.43 81.05,129.77 v81.05,157.89
C_CH4  (1 unrouted)
  Top 0.508: R12.1 103.63,160.02 102.36,161.29 IC1.9
C_CH4N  (1 unrouted)
CH1  (via drill 0.35)
  Top 0.305: DAC1.2 148.85,133.87 148.34,133.35 147.57,133.35 142.75,138.18 v142.75,139.95
  Top 0.508: v26.29,185.17 26.29,186.94 28.07,189.23 136.14,189.23 138.68,186.69 v138.68,184.15
  Top 0.61: U1.3 26.16,181.23 v26.29,181.36
  Bottom 0.305: v142.75,139.95 142.75,146.05 138.68,150.37 v138.68,184.15
  Bottom 0.61: v26.29,181.36 v26.29,185.17
CH2  (via drill 0.35)
  Top 0.305: v26.72,111.76 26.72,113.89 28.5,115.67 67.61,115.67 82.14,130.2 147.73,130.2 149.35,131.83 DAC1.3
  Top 0.61: U3.3 25.09,107.82 26.67,107.82 v26.72,107.87
  Bottom 0.61: v26.72,107.87 v26.72,111.76
CH3  (via drill 0.35)
  Top 0.305: v85.88,110.34 85.88,115.59 98.73,128.45 147.83,128.45 149.84,130.45 149.84,135.2 DAC1.4
  Top 0.61: U4.3 v85.9,106.48
  Bottom 0.61: v85.9,106.48 85.9,110.31 v85.88,110.34
CH4  (1 unrouted)
DIN
  Top 0.508: UC1.11 126.49,149.61 126.49,144.02 126.11,143.64 U2.3
DIN_ISO
  Top 0.305: U2.14 147.45,143.64 149.35,141.73 DAC1.8
GND  (via drill 0.35)  (3 unrouted)
  Top 0.305: 118.62,146.12 C9.1
  Top 0.406: U2.2 118.62,144.91
  Top 0.508: v117.35,156.46 98.81,156.46 95.25,160.02 IC1.7 87.63,160.02 v73.66,146.05 | v68.58,146.05 62.23,146.05 54.48,138.3 J1.1 | U2.8 119.89,137.29 118.62,138.56 118.62,144.91 118.62,146.12
  Top 0.61: K2.2 CP1.- 174.24,176.53 C1.2 | C1.2 171.77,179 R1.1 REG1.GND 161.54,185.42 158.75,182.63 158.75,171.2 156.72,169.16 150.62,169.16 148.59,167.13 CON_AC.GND | CP2.- 169.16,178.82 C1.2 | v144.78,188.98 143,188.98 141.22,187.2 141.22,184.15 139.95,182.88 UC1.AGND 129.79,182.88 127.25,185.42 UC1.GND 111.51,185.42 108.97,182.88 K1.2 102.49,182.88 101.42,181.81 101.42,176.2 103.07,174.55 111,174.55 v112.85,174.52 112.87,175.76 R53.2 | v117.35,156.46 118.43,155.38 C9.1
  Bottom 0.508: v73.66,146.05 v68.58,146.05
  Bottom 0.61: REG1.GND 161.29,185.42 157.73,188.98 v144.78,188.98 | v112.85,174.52 114.66,174.52 117.37,171.81 117.37,156.49 v117.35,156.46
  Bottom 0.813: RL6.2 73.05,53.65 75.97,50.72 75.97,48.64 | 75.97,48.64 75.97,46.43 77.42,44.98 100.69,44.98 102.46,46.76 102.46,50.85 105.21,53.59 RL5.2 | J2.1 75.97,48.64
GS_CH1  (via drill 0.35)  (2 unrouted)
  Top 0.61: U1.14 30.36,184.66 30.35,185.17 | 30.35,185.17 32.38,187.2 48.64,187.2 50.69,185.15 VR2.3 VR2.2 | U1.5 v27.53,178.69 U1.10 | v27.56,185.17 30.35,185.17
  Bottom 0.61: v27.53,178.69 v27.56,185.17
N$1
  Top 0.61: REG1.IN 179.04,187.96 LED1.A 184.12,187.99 D1.C 184.15,182.37 181.86,180.09 CP1.+
N$2
  Top 0.61: R54.1 R53.1 112.71,177.8 K1.4
N$3
  Top 0.61: R1.2 176.78,185.42 177.29,185.93 179.04,185.93 LED1.C
N$4
  Top 0.61: UC1.1 R54.2
N$5
  Top 0.61: U1.2 21.11,182.5 19.96,181.36 14.02,181.36 12.98,182.4 VR1.3 12.96,183.81 R3.2
N$6
  Top 0.61: U1.8 32.13,176.15 37.44,170.84 41.96,170.84 43.05,169.75 Q1.B
N$7
  Top 0.61: VR1.2 VR1.1 18.78,183.77 U1.1 27.18,183.77 29.72,181.23 U1.12
N$8
  Top 0.406: REG2.4 REG2.3 155.89,180.15 D2.C 155.96,176.6 | 155.96,176.6 C2.1 | LED2.A 155.99,176.6 155.96,176.6
N$9
  Top 0.406: R2.2 150.37,172.21 151.64,170.94 LED2.C
N$10  (3 unrouted)
N$11  (3 unrouted)
N$12
  Top 0.61: Q1.E 48.13,172.21 46.35,173.99 36.96,173.99 33.48,177.42 U1.9
  Top 0.813: Q1.E R5.2
N$13  (2 unrouted)
N$14
  Top 0.61: U1.7 Q2.B
N$15  (via drill 0.35)
  Top 0.61: VR2.1 49.4,178.56 47.88,180.09 47.88,182.37 46.1,184.15 v42.8,184.15 R4.2 | v32.11,182.63 31.8,182.5 U1.13
  Bottom 0.61: v42.8,184.15 34.92,184.15 v32.11,182.63
N$16
  Top 0.61: U1.6 26.16,177.42 29.84,173.74 Q2.E
  Top 0.813: Q2.E R6.2
N$17
  Top 0.813: Q2.C 27.3,162.05 | 27.3,162.05 Q6.C | C6.2 17.65,164.59 20.19,162.05 27.3,162.05
  Bottom 0.813: Q7.B 32.38,139.19 34.67,141.48 34.67,149.86 33.15,151.38 28.83,151.38 27.3,152.91 Q6.C
N$18
  Top 0.61: D3.C 183.9,165.86 181.86,163.83 CP4.+ 179.8,163.86 LED3.A 164.63,163.86 REG3.IN
N$19  (via drill 0.35)
  Top 0.61: v44.07,172.72 45.59,171.2 Q1.C
  Top 0.813: Q1.C Q4.C
  Bottom 0.61: C5.1 v44.07,172.72
  Bottom 0.813: Q4.C 45.59,154.18 48.13,151.64 50.67,151.64 52.45,149.86 52.45,140.97 50.67,139.19 Q5.B
N$20
  Top 0.61: R11.2 173.26,161.04 LED3.C
N$21
  Top 0.813: Q4.E R7.1
N$22
  Top 0.813: Q3.E R8.1
N$23
  Top 0.508: U2.10 136.84,138.56 R13.1
N$24
  Top 0.813: Q3.C Q3.B | Q4.B Q3.B | Q3.B Q5.E
N$25
  Top 0.61: R16.2 UC1.6
N$26
  Top 0.61: R15.2 UC1.7
N$27
  Top 0.813: Q6.B Q8.B Q8.C 27.3,144.53 24.77,141.99 Q7.E
N$28
  Top 0.813: R9.2 Q6.E
N$29
  Top 0.813: R10.2 Q8.E
N$30
  Top 0.61: R14.2 UC1.8
N$31
  Top 0.61: R12.2 UC1.9
N$32
  Top 0.61: RL1.1 R17.2
N$33
  Top 0.61: RL2.1 R18.2
N$34
  Top 0.61: U3.2 21.34,109.07 19.51,107.24 13.61,107.24 12.8,108.05 VR3.3 12.8,112.69 R20.2
N$35
  Top 0.61: VR3.2 VR3.1 18.96,110.34 U3.1 26.75,110.34 29.29,107.8 U3.12
N$36
  Top 0.813: RL1.4 R19.1
N$37  (via drill 0.35)  (1 unrouted)
  Top 0.61: U3.5 v27.86,105.26 U3.10 | v27.91,111.71 30.66,111.71 U3.14 | VR4.2 VR4.3
  Bottom 0.61: v27.86,105.26 27.86,111.68 27.89,111.71 v27.91,111.71
N$38
  Top 0.813: RL2.4 K_CH1.1
N$39  (via drill 0.35)
  Top 0.61: R21.2 42.9,110.72 42.93,110.74 42.95,110.74 v42.98,110.72 46.38,110.72 48.13,108.97 48.13,106.68 49.58,105.23 VR4.1 | v32.59,109.09 32.56,109.07 U3.13
  Bottom 0.61: v42.98,110.72 36.45,110.72 34.8,109.07 32.59,109.07 v32.59,109.09
N$40
  Top 0.61: Q9.E 48.62,98.25 45.87,100.91 36.35,100.94 33.27,103.99 U3.9
  Top 0.813: Q9.E 53.26,94.49 R22.2
N$41
  Top 0.61: U3.7 25.06,94.61 Q10.B
N$42
  Top 0.61: U3.6 26.24,103.99 30.15,100.08 30.15,94.61 Q10.E 30.18,94.64
  Top 0.813: 30.18,94.64 R23.2
N$43
  Top 0.61: 21.77,88.62 21.82,88.67
  Top 0.813: Q10.C 27.58,88.67 | 27.58,88.67 27.58,83.16 Q14.C | C12.2 18.52,91.87 21.77,88.62 | 21.82,88.67 27.58,88.67
  Bottom 0.813: Q14.C 27.61,80.03 29.21,78.44 33.15,78.44 34.52,77.06 34.52,67.69 32.64,65.81 30.25,65.81 Q15.B
N$44  (via drill 0.35)
  Top 0.61: v43.51,99.52 46.02,97.05 Q9.C
  Top 0.813: Q9.C 46.08,82.8 Q12.C
  Bottom 0.61: C13.1 43.43,99.59 v43.51,99.52
  Bottom 0.813: Q12.C 45.87,80.26 48.34,77.8 50.77,77.8 52.48,76.1 52.48,67.41 52.5,67.39 50.83,65.71 Q13.B
N$45
  Top 0.813: Q12.E 57.66,82.6 R24.1
N$46
  Top 0.813: Q11.E R25.1
N$47
  Top 0.813: Q11.C Q11.B | Q12.B 43.33,74.19 Q11.B | Q11.B 43.26,65.79 Q13.E
N$48
  Top 0.813: Q14.B 30.23,83.06 Q16.B Q16.C 27.69,71.2 25.09,68.61 25.09,65.89 Q15.E
N$49
  Top 0.813: Q14.E 25.04,83.16 R26.2
N$50
  Top 0.813: Q16.E 17.63,74.45 R27.2
N$51
  Top 0.61: U3.8 32.46,102.72 36.96,98.22 41.86,98.22 43.54,96.55 Q9.B
N$52
  Top 0.61: R29.2 RL3.1
N$53
  Top 0.61: R30.2 13.31,56.16 RL4.1
N$54
  Bottom 0.813: RL3.4 57.58,51.26 55.96,52.88 55.96,64.29 R28.1
N$55
  Top 0.813: RL4.4 32.26,51.1 K_CH2.1
N$56  (2 unrouted)
N$57  (2 unrouted)
N$58
  Top 0.508: U4.2 82.5,107.75 81.71,106.96 74.5,106.96 73.84,107.59 VR5.3 73.89,112.34 74.98,113.44 R31.2
N$59
  Top 0.508: VR5.2 VR5.1 83.17,109.02 U4.1 85.75,109.02 88.27,106.5 89.77,106.5 U4.12
N$60  (via drill 0.35)
  Top 0.508: U4.5 87.1,103.94 v87.12,103.91 89.77,103.91 U4.10 | v87.96,108.99 89.77,108.99 U4.14
  Top 0.61: VR6.2 VR6.3 106.77,111.68 90.98,111.68 89.77,110.47 89.77,108.99
  Bottom 0.508: v87.12,103.91 87.12,108.15 v87.96,108.99
N$61  (via drill 0.35)
  Top 0.61: R32.2 100.95,109.3 v104.19,109.3 105.36,109.3 106.4,108.25 106.4,105.13 107.59,103.94 107.62,103.96 VR6.1 | U4.13 91.92,107.75 v93.45,109.27
  Bottom 0.61: v93.45,109.27 93.5,109.32 104.22,109.32 v104.19,109.3
N$62
  Top 0.61: U4.9 91.87,102.67 95.61,98.93 104.57,98.93 106.91,96.6 106.91,93.47 Q17.E
  Top 0.813: Q17.E 111.53,93.45 R33.2
N$63
  Top 0.61: U4.7 84.19,93.31 Q18.B
N$64
  Top 0.61: U4.6 85.78,102.64 89.26,99.16 Q18.E
  Top 0.813: R34.2 89.28,93.32 Q18.E
N$65
  Top 0.813: C18.2 78.23,91.82 81.76,88.29 86.72,88.29 | Q18.C 86.72,88.29 | 86.72,88.29 86.72,82.86 Q22.C
  Bottom 0.813: Q22.C 86.74,80.44 89.31,77.88 91.64,77.88 92.86,76.66 92.86,66.95 91.39,65.48 Q23.B
N$66
  Top 0.813: Q17.C 104.34,82.25 Q20.C
  Bottom 0.813: C19.1 102.21,99.39 104.39,97.21 104.39,93.5 Q17.C | Q20.C 104.39,79.76 106.32,77.83 109.17,77.83 111.48,75.51 111.48,67.39 109.7,65.61 Q21.B
N$67
  Top 0.813: Q20.E R35.1
N$68
  Top 0.813: Q19.E R36.1
N$69
  Top 0.813: Q19.B Q19.C | Q20.B 101.85,73.23 Q19.B | Q19.B 101.88,65.63 Q21.E
N$70
  Top 0.813: Q23.E 84.48,68.28 86.77,70.56 Q24.C Q24.B 89.31,82.8 Q22.B
N$71
  Top 0.813: R37.2 84.15,82.88 Q22.E
N$72
  Top 0.813: R38.2 84.2,74.02 Q24.E
N$73
  Top 0.61: U4.8 90.75,101.4 94.87,97.28 100.69,97.28 101.83,96.14 101.8,96.11 Q17.B
N$74
  Top 0.813: R40.2 108.46,56.16 RL5.1
N$75
  Top 0.813: R41.2 RL6.1 71.7,56.16
N$76
  Bottom 0.813: RL5.4 114.45,51.05 113,52.5 113,64.16 116.26,67.41 116.28,67.39 R39.1
N$77
  Top 0.813: RL6.4 90.07,51.1 K_CH3.1
N$78  (2 unrouted)
N$79  (3 unrouted)
N$80  (4 unrouted)
N$81  (2 unrouted)
N$82  (2 unrouted)
N$83  (1 unrouted)
N$84  (2 unrouted)
N$85  (3 unrouted)
N$86  (3 unrouted)
N$87  (1 unrouted)
N$88  (1 unrouted)
N$89  (3 unrouted)
N$90  (3 unrouted)
N$91  (1 unrouted)
N$92  (1 unrouted)
N$93  (1 unrouted)
N$94  (1 unrouted)
N$95  (1 unrouted)
N$96  (1 unrouted)
N$97  (1 unrouted)
N$98  (3 unrouted)
N$99  (3 unrouted)
N$100  (2 unrouted)
N$101  (2 unrouted)
N$102  (1 unrouted)
N$103
  Top 0.61: K1.3 109.73,180.34 112.27,182.88 UC1.0
N$104
  Top 0.813: RL2.2 15.04,128.27 17.35,125.96 17.35,121.64 19.63,119.36 43.38,119.36 45.36,121.34 45.36,125.75 47.88,128.27 RL1.2 53.34,128.27 54.48,129.41 J1.2
N$105
  Bottom 0.813: RL4.2 15.8,53.65 16.82,52.63 16.82,46.56 18.44,44.93 42.34,44.93 44.37,46.97 44.37,50.09 44.32,50.14 47.98,53.8 RL3.2 52.38,53.8 53.72,52.45 53.72,50.16 55.12,48.77 59.44,48.77 J2.2
N$106  (2 unrouted)
N$107  (2 unrouted)
N$108  (1 unrouted)
N$109  (2 unrouted)
N$110  (2 unrouted)
N$127  (1 unrouted)
N$129  (1 unrouted)
N$131  (1 unrouted)
PE  (via drill 0.35)  (23 unrouted)
  Top 0.305: U2.15 138.94,144.91 | 150.37,145.03 150.37,139.63 DAC1.6 | C10.2 138.87,144.97 138.94,144.91 | 150.37,145.03 150.24,144.91 138.94,144.91 | v154.69,161.29 154.69,151.64 150.37,147.32 150.37,145.03
  Top 0.406: REG2.2 154.94,181.1 153.92,180.09 | 153.92,180.09 147.41,180.09 CP3.- | C2.2 153.92,177.8 153.92,180.09 | R2.1 150.37,176.78 C2.2 | C2.2 153.99,174.56 v153.92,174.5 | REG3.GND v154.69,161.29
  Top 0.508: U2.15 132.21,144.91 131.57,144.27 131.57,138.18 132.46,137.29 U2.9 | VR9.1 16.02,5.6 16.89,6.48 C30.1 24.32,7.81 24.83,8.32 C32.1 | C31.2 18.8,24.32 C33.2
  Top 0.61: REG3.GND 168.72,161.29 R11.1 168.98,156.46 | K3.2 CP4.- 179.83,158.24 178.05,156.46 C11.2 168.98,156.46 | 168.98,156.46 168.98,153.99 CP5.- | C5.2 40.01,180.09 37.28,182.81 R4.1 37.21,184.08 C4.2 v33.91,185.93 | C6.1 v15.11,174.75 C3.1 | R21.1 34.33,110.72 C17.2 34.24,112.52 34.21,112.55 v34.21,113.36 | v15.95,101.52 15.96,101.51 C16.1 | 16,101.47 v15.95,101.52 | v15.95,101.52 15.95,94.64 C12.1 | C27.2 98.99,109.31 R32.1 99.02,105.98 v100.25,104.75 102.18,104.75 C19.2
  Top 0.813: C7.1 14.99,167.77 C6.1 | C13.2 40.36,106.4 37.78,108.98 R21.1 | C14.1 15.93,94.61 15.95,94.64 | C26.1 C18.1 | 75.64,93.75 C18.1 | 75.67,93.78 C18.1 | K_CH3.2 99.62,51.08 104.17,46.53 118.03,46.53 120.02,48.51 R39.2 | K_CH2.2 41.94,46.51 61.57,46.51 62.89,47.83 R28.2 | C18.1 75.69,91.72 70.56,86.59 C20.1 70.59,82.7 v70.61,81.53
  Bottom 0.406: v153.92,174.5 154.69,173.74 v154.69,161.29
  Bottom 0.61: v33.91,185.93 33.15,186.69 25.27,186.69 15.11,176.53 v15.11,174.75 | v34.21,113.36 34.21,113.39 25.55,113.39 16,103.83 16,101.52 v15.95,101.52 | C13.2 43.36,106.32 | R34.1 96.55,97.31 100.25,101.02 v100.25,104.75 | R33.1 118.31,93.52 123.57,88.27 123.57,63.75 122.12,62.31 R39.2
  Bottom 0.813: R6.1 37.72,169.67 38.99,170.94 40.26,170.94 | 40.26,170.94 55.5,170.94 | 55.5,170.94 R5.1 55.5,166.88 57.28,165.1 65.15,165.1 66.93,163.32 R19.2 65.15,130.81 63.63,129.29 63.63,123.44 61.85,121.67 37.44,121.72 | C5.2 41.78,180.09 40.26,178.31 40.26,170.94 | 37.44,121.72 37.47,123.44 K_CH1.2 | C8.1 58.16,176.66 55.5,173.99 55.5,170.94 | 39.83,98.53 37.9,96.6 R23.1 37.9,92.51 34.29,88.9 18.29,88.9 15.98,91.21 C12.1 | 39.83,98.53 55.83,98.53 | 55.83,98.53 R22.1 55.83,88.59 62.89,81.53 | C15.1 57.51,103.25 55.83,101.58 55.83,98.53 | 43.36,106.32 41.45,106.32 39.83,104.7 39.83,98.53 | C19.2 103.78,104.72 109.8,98.7 114.12,98.7 114.15,98.68 | R33.1 114.15,98.68 | 114.15,98.68 118.39,98.68 119.43,99.8 C21.1 | 62.89,81.53 R28.2 | v70.61,81.53 62.89,81.53 | 37.44,121.72 34.21,118.49 34.21,113.39
S_CH1
  Top 0.813: Q7.C 27.3,134.87 | 27.3,134.87 45.59,134.87 | 45.59,134.87 Q5.C | 27.3,134.87 23.24,134.87 21.21,132.84 RL2.6 | 45.59,134.87 57.28,134.87 59.05,133.1 RL1.6
S_CH2
  Top 0.813: RL4.6 20.95,58.45 23.16,60.63 27.69,60.6 | 27.69,60.6 45.87,60.63 | 45.87,60.63 56.95,60.58 58.83,58.67 RL3.6 | Q15.C 27.69,60.6 | Q13.C 45.9,62.03 45.87,60.63
S_CH3
  Top 0.813: Q23.C 87.02,60.55 | 87.02,60.55 104.39,60.55 | 104.39,60.55 Q21.C | 104.39,60.55 113.79,60.55 116.08,58.27 RL5.6 | RL6.6 82.65,56.19 87.02,60.55
S_CH4  (3 unrouted)
SCL
  Top 0.61: UC1.19/A5 144.78,167.64 146.05,166.37 CON_AC.SCL
SCLK
  Top 0.508: UC1.13 131.32,152.4 129.03,150.11 129.03,143.51 126.62,141.1 U2.5
SCLK_ISO
  Top 0.305: U2.12 147.7,141.1 148.35,140.45 DAC1.10
SDA
  Top 0.61: UC1.18/A4 CON_AC.SDA
V+  (6 unrouted)
  Top 0.813: R8.2 R7.2 61.59,153.92 63.37,155.7 C8.2 | R25.2 57.68,76.68 R24.2 60.27,80.09 62.2,82.02 C15.2 | R36.2 R35.2 118.34,82.17 119.43,83.44 C21.2
V-  (via drill 0.35)  (4 unrouted)
  Top 0.813: R9.1 17.14,151.89 | 17.14,151.89 R10.1 | 17.14,151.89 17.02,151.77 C7.2 v1.42,151.72 v1.42,151.71 | R27.1 17.6,78.59 | 17.6,78.59 17.6,80.59 R26.1 | C14.2 17.58,78.61 17.6,78.59 | C20.2 70.56,73 74.12,76.56 R38.1 77.6,80.34 R37.1
  Bottom 0.813: v1.42,151.71 1.42,81.18 3.94,78.66 3.94,78.67 C14.2 8.66,45.19 11.18,42.67 62.99,42.67 66.55,46.23 66.55,63.73 C20.2
VREF  (via drill 0.35)  (1 unrouted)
  Top 0.305: DAC1.1 148.34,135.23 148.34,136.91 149.85,138.42 DAC1.7 149.85,143.26 v149.35,143.76 | CP3.+ 139.95,178.21 v139.95,170.43 | 12.79,114.66 R20.1
  Top 0.406: REG2.5 147.32,185.5 CP3.+
  Top 0.508: CP3.+ 147.32,188.98 145.8,190.5 10.79,190.5 7.95,187.66 R3.1 6.21,185.68 4.93,184.4 v4.93,153.81 | 12.79,114.66 9.3,114.66 4.93,119.02 4.93,149.25 4.95,149.28 4.93,149.3 v4.93,149.43 | R20.1 24.98,114.61 27.23,116.86 67.08,116.92 v67.11,116.94
  Top 0.61: v78.23,116.94 78.22,116.93 R31.1
  Bottom 0.305: v139.95,170.43 139.95,153.16 v149.35,143.76
  Bottom 0.508: v4.93,149.43 v4.93,153.81
  Bottom 0.61: v67.11,116.94 v78.23,116.94